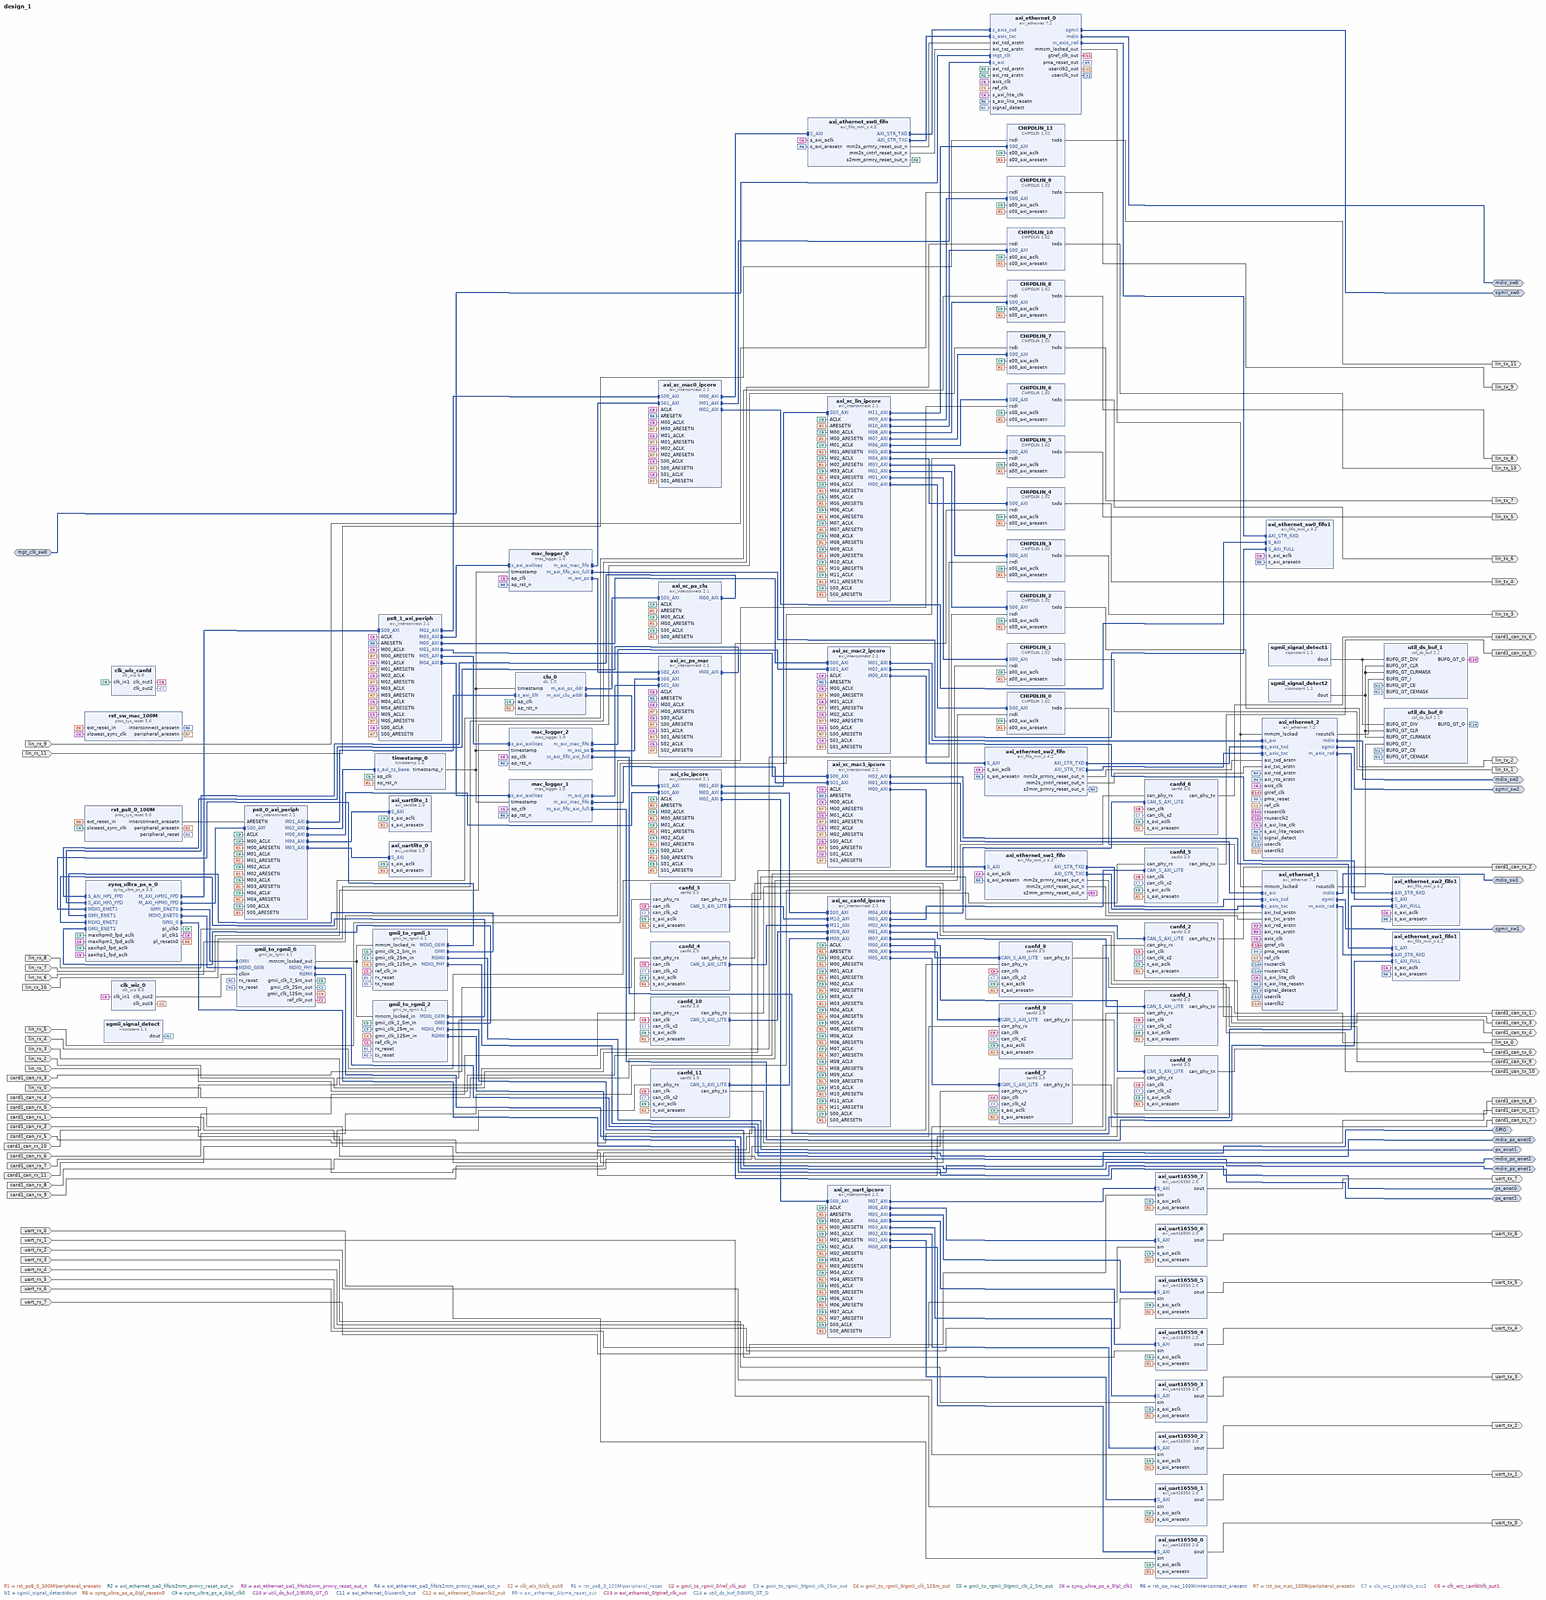
[diagram p0: block diagram of the top level, whole]
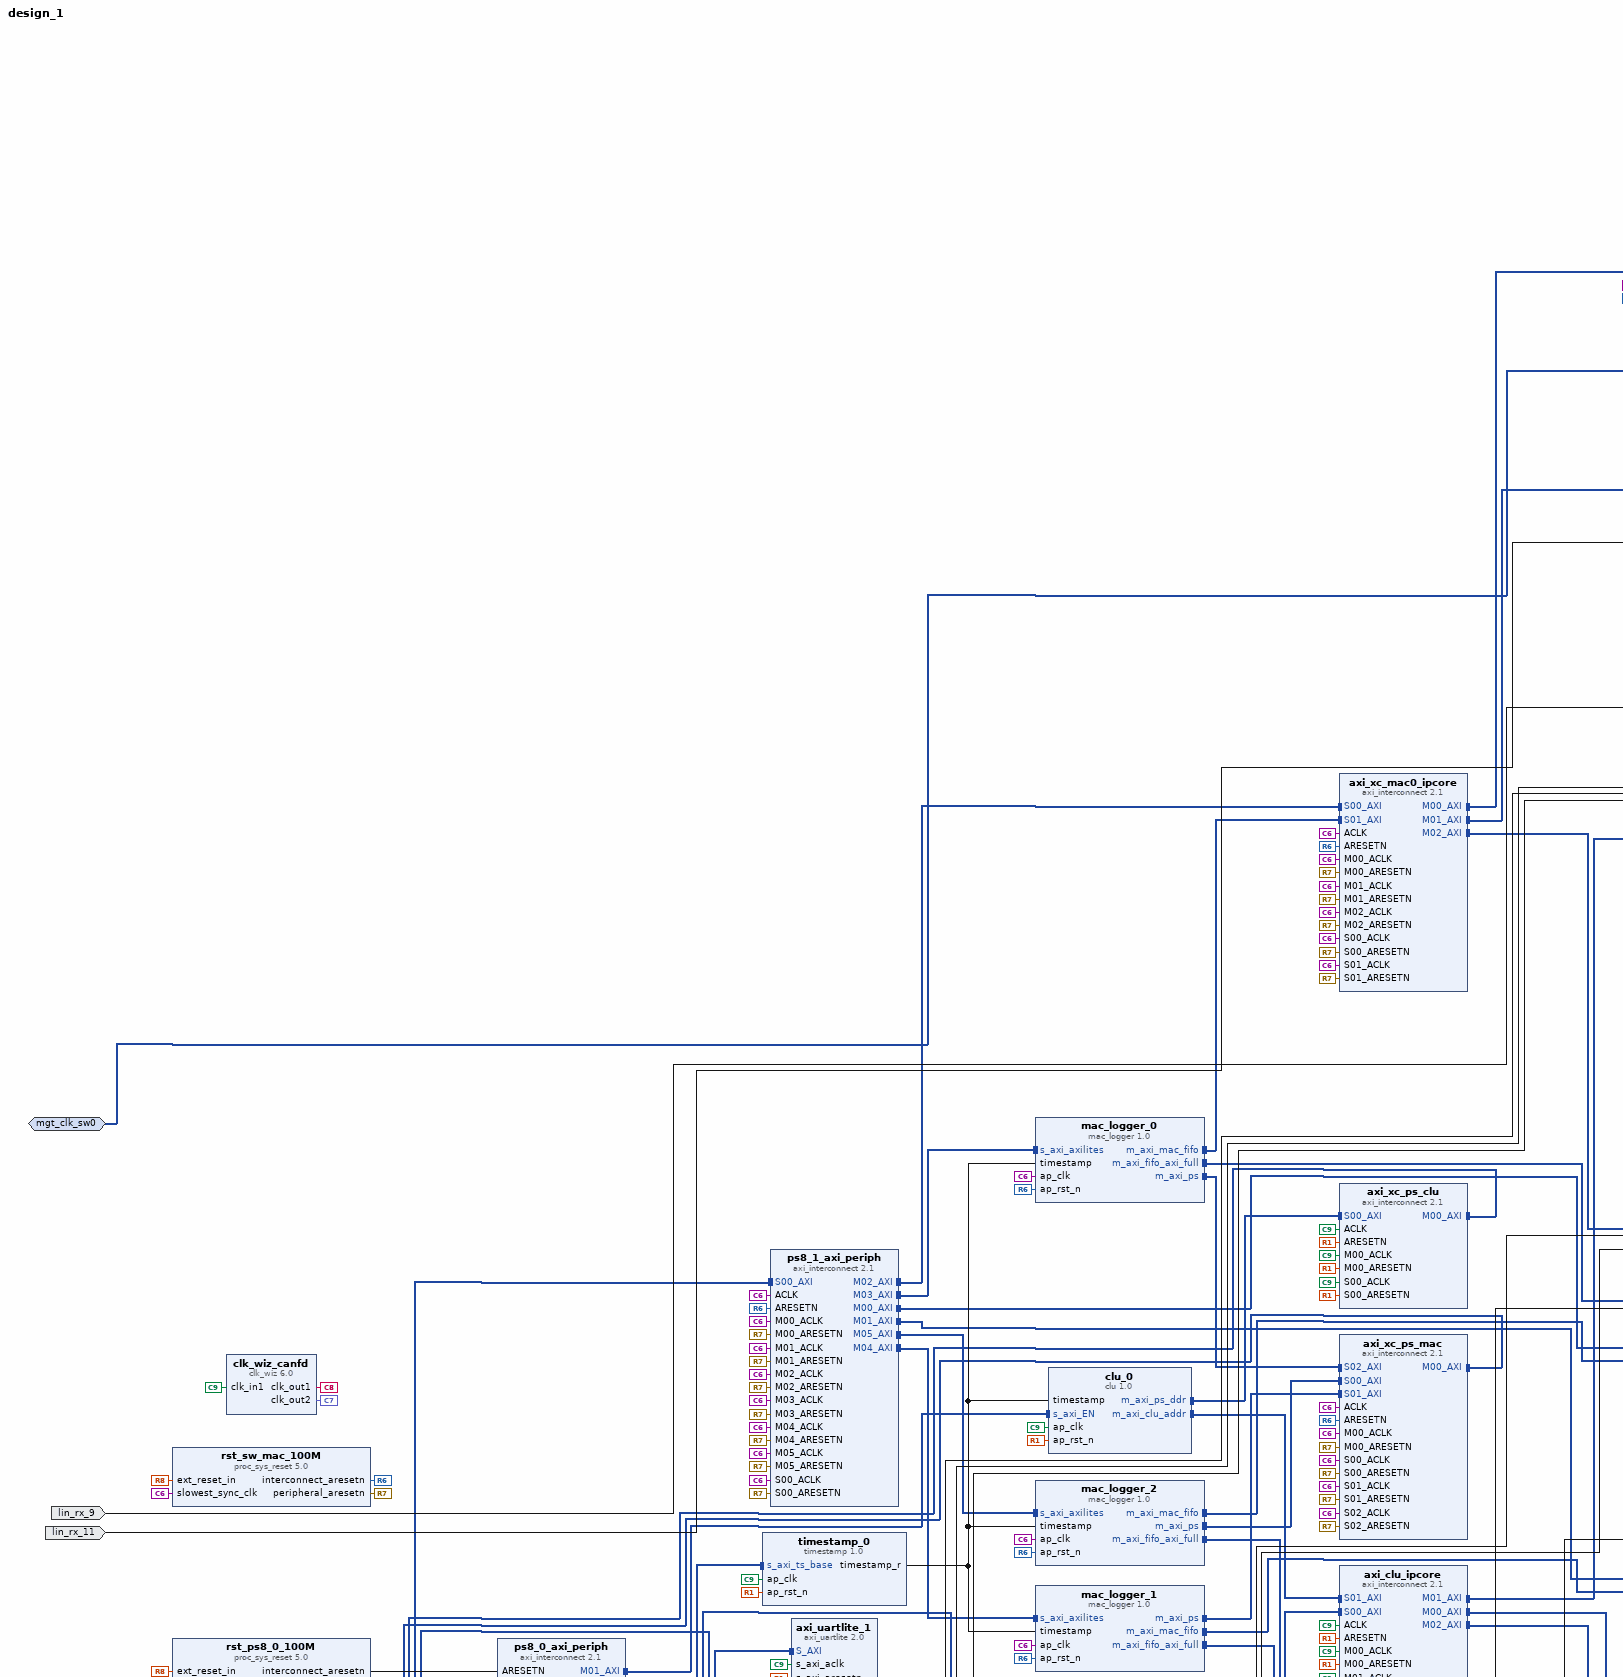
[diagram p1: block diagram of the top level, upper left part]
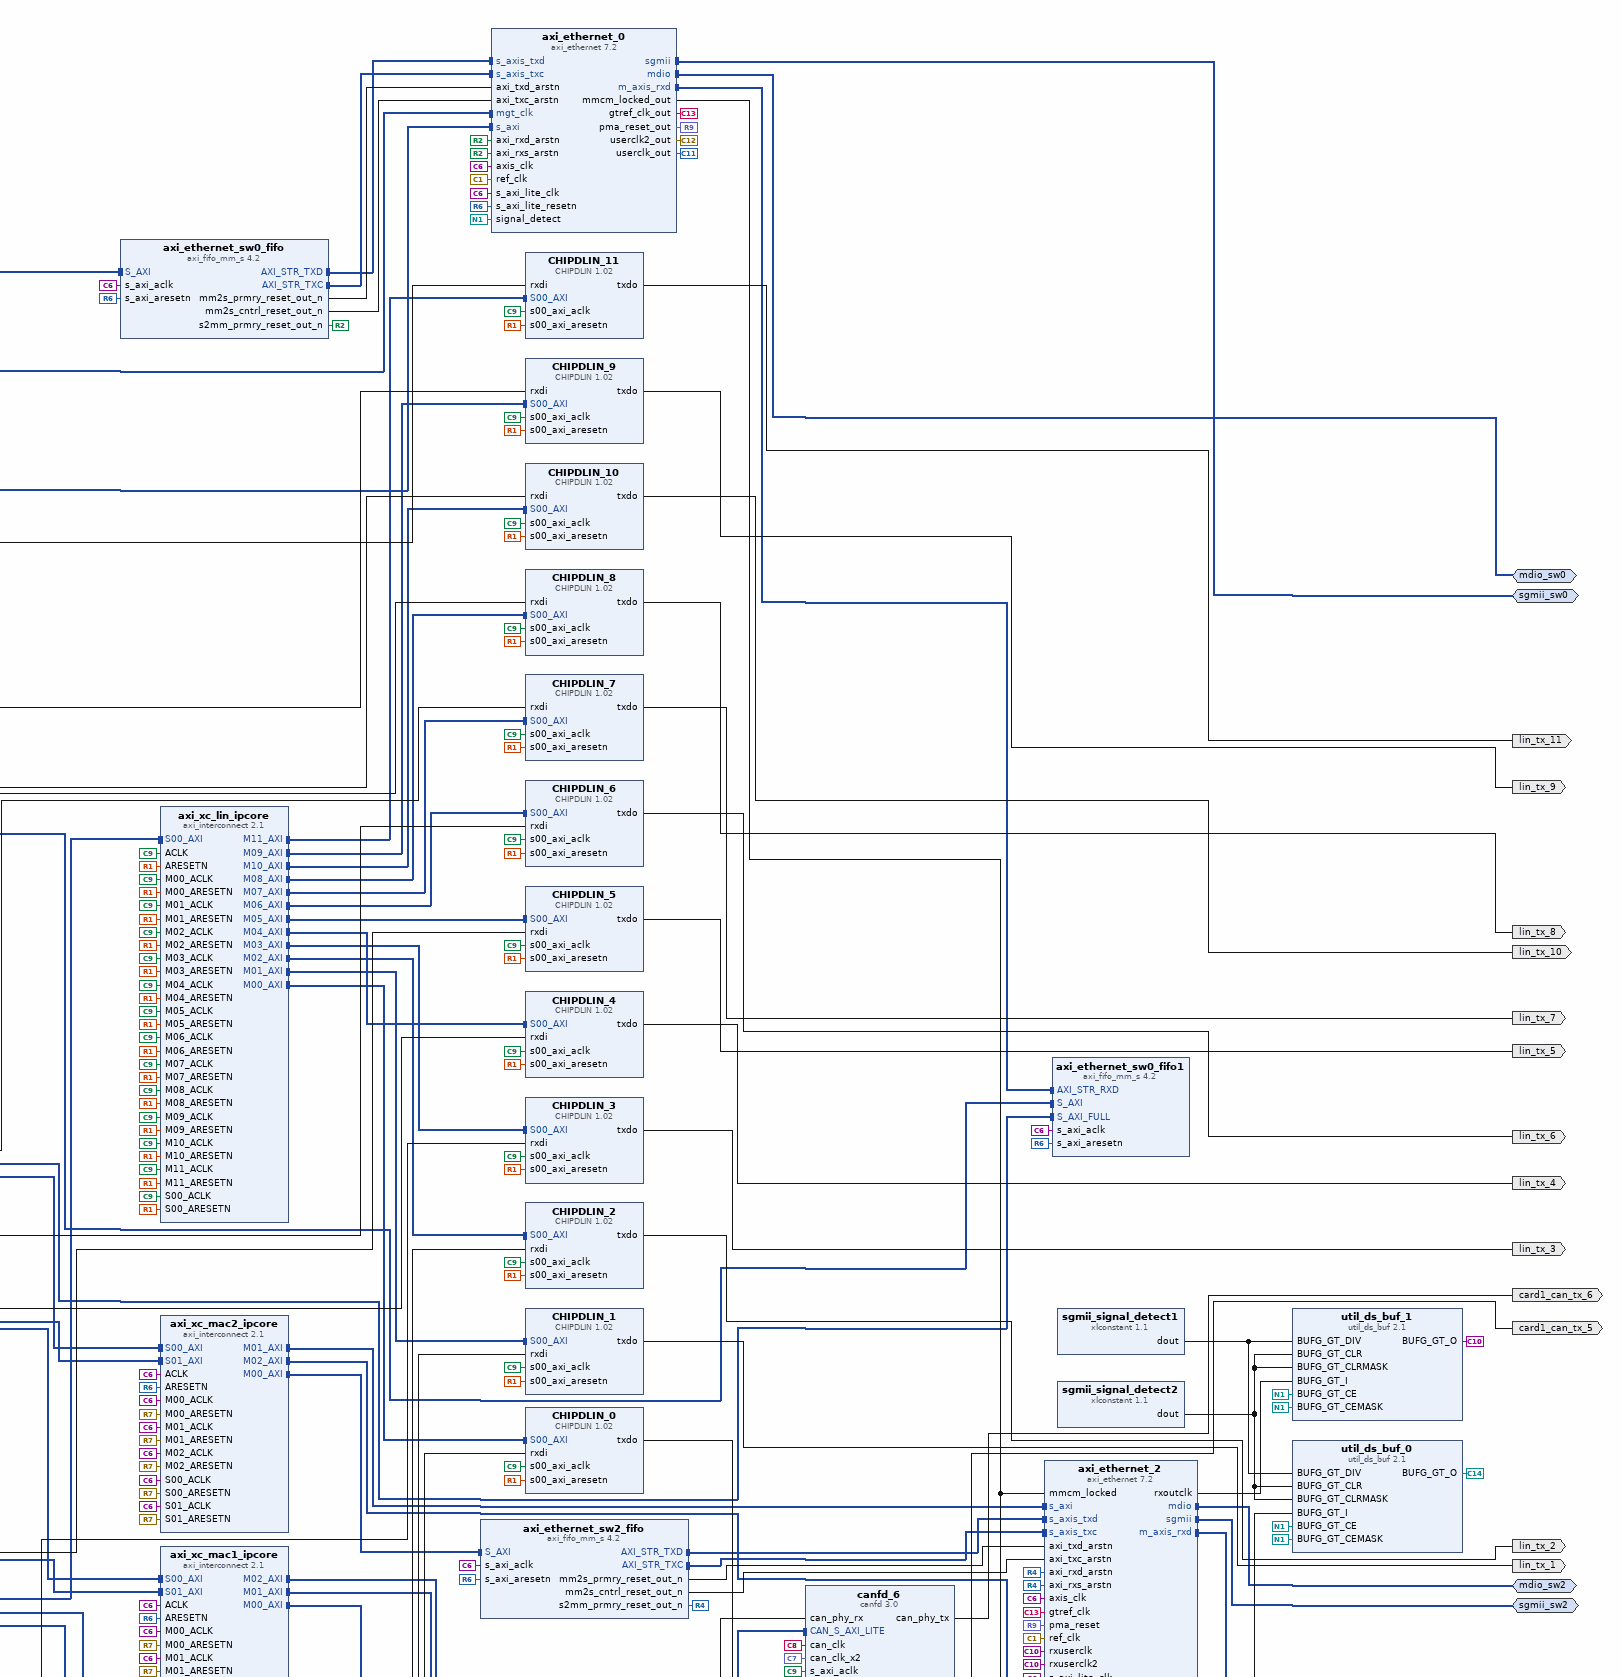
[diagram p2: block diagram of the top level, upper right part]
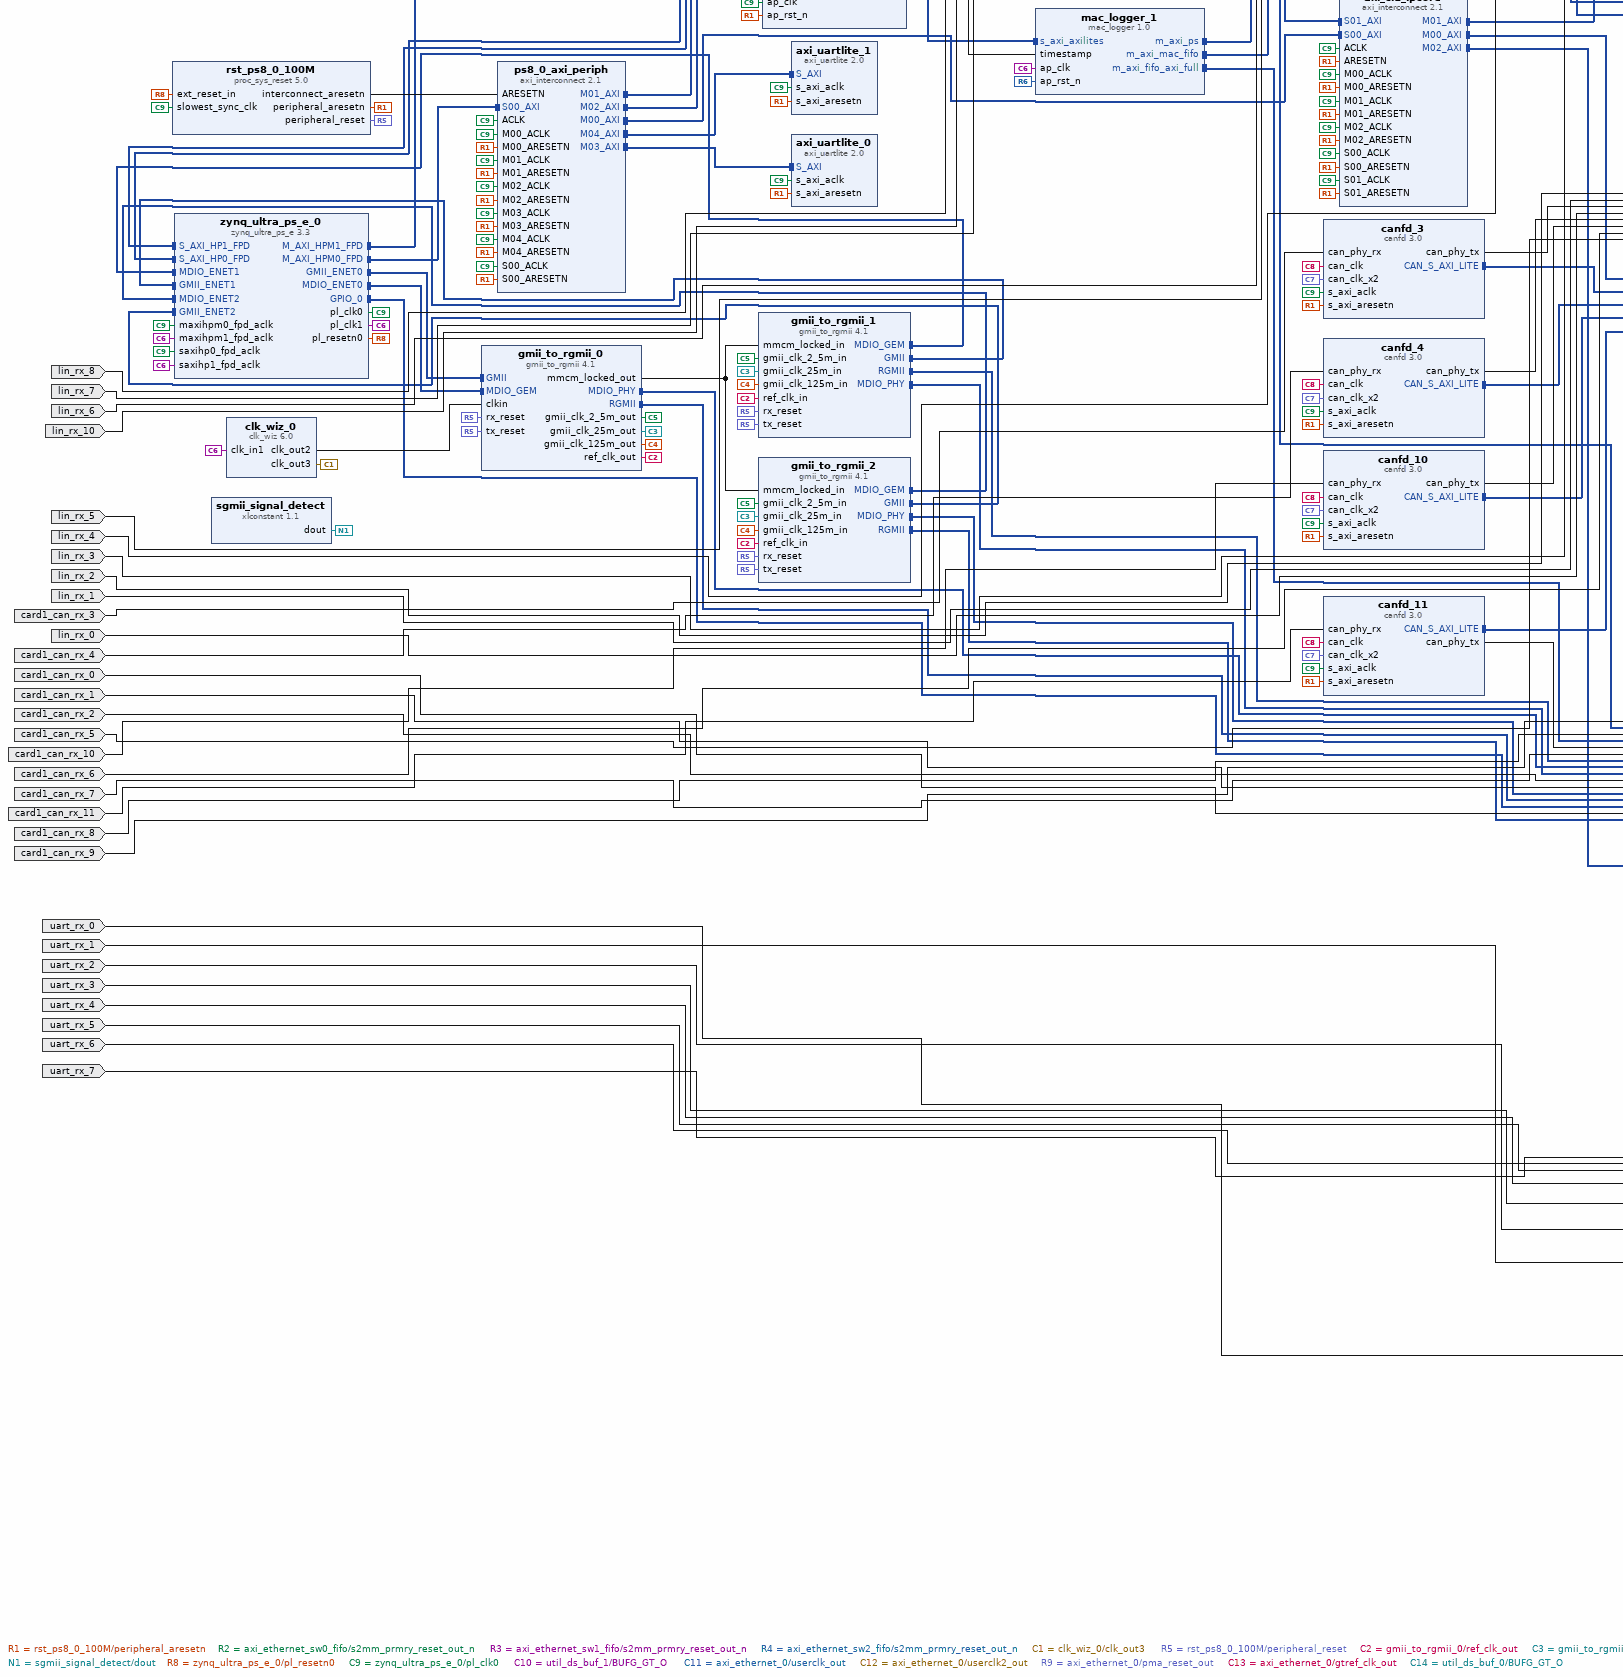
[diagram p3: block diagram of the top level, lower left part]
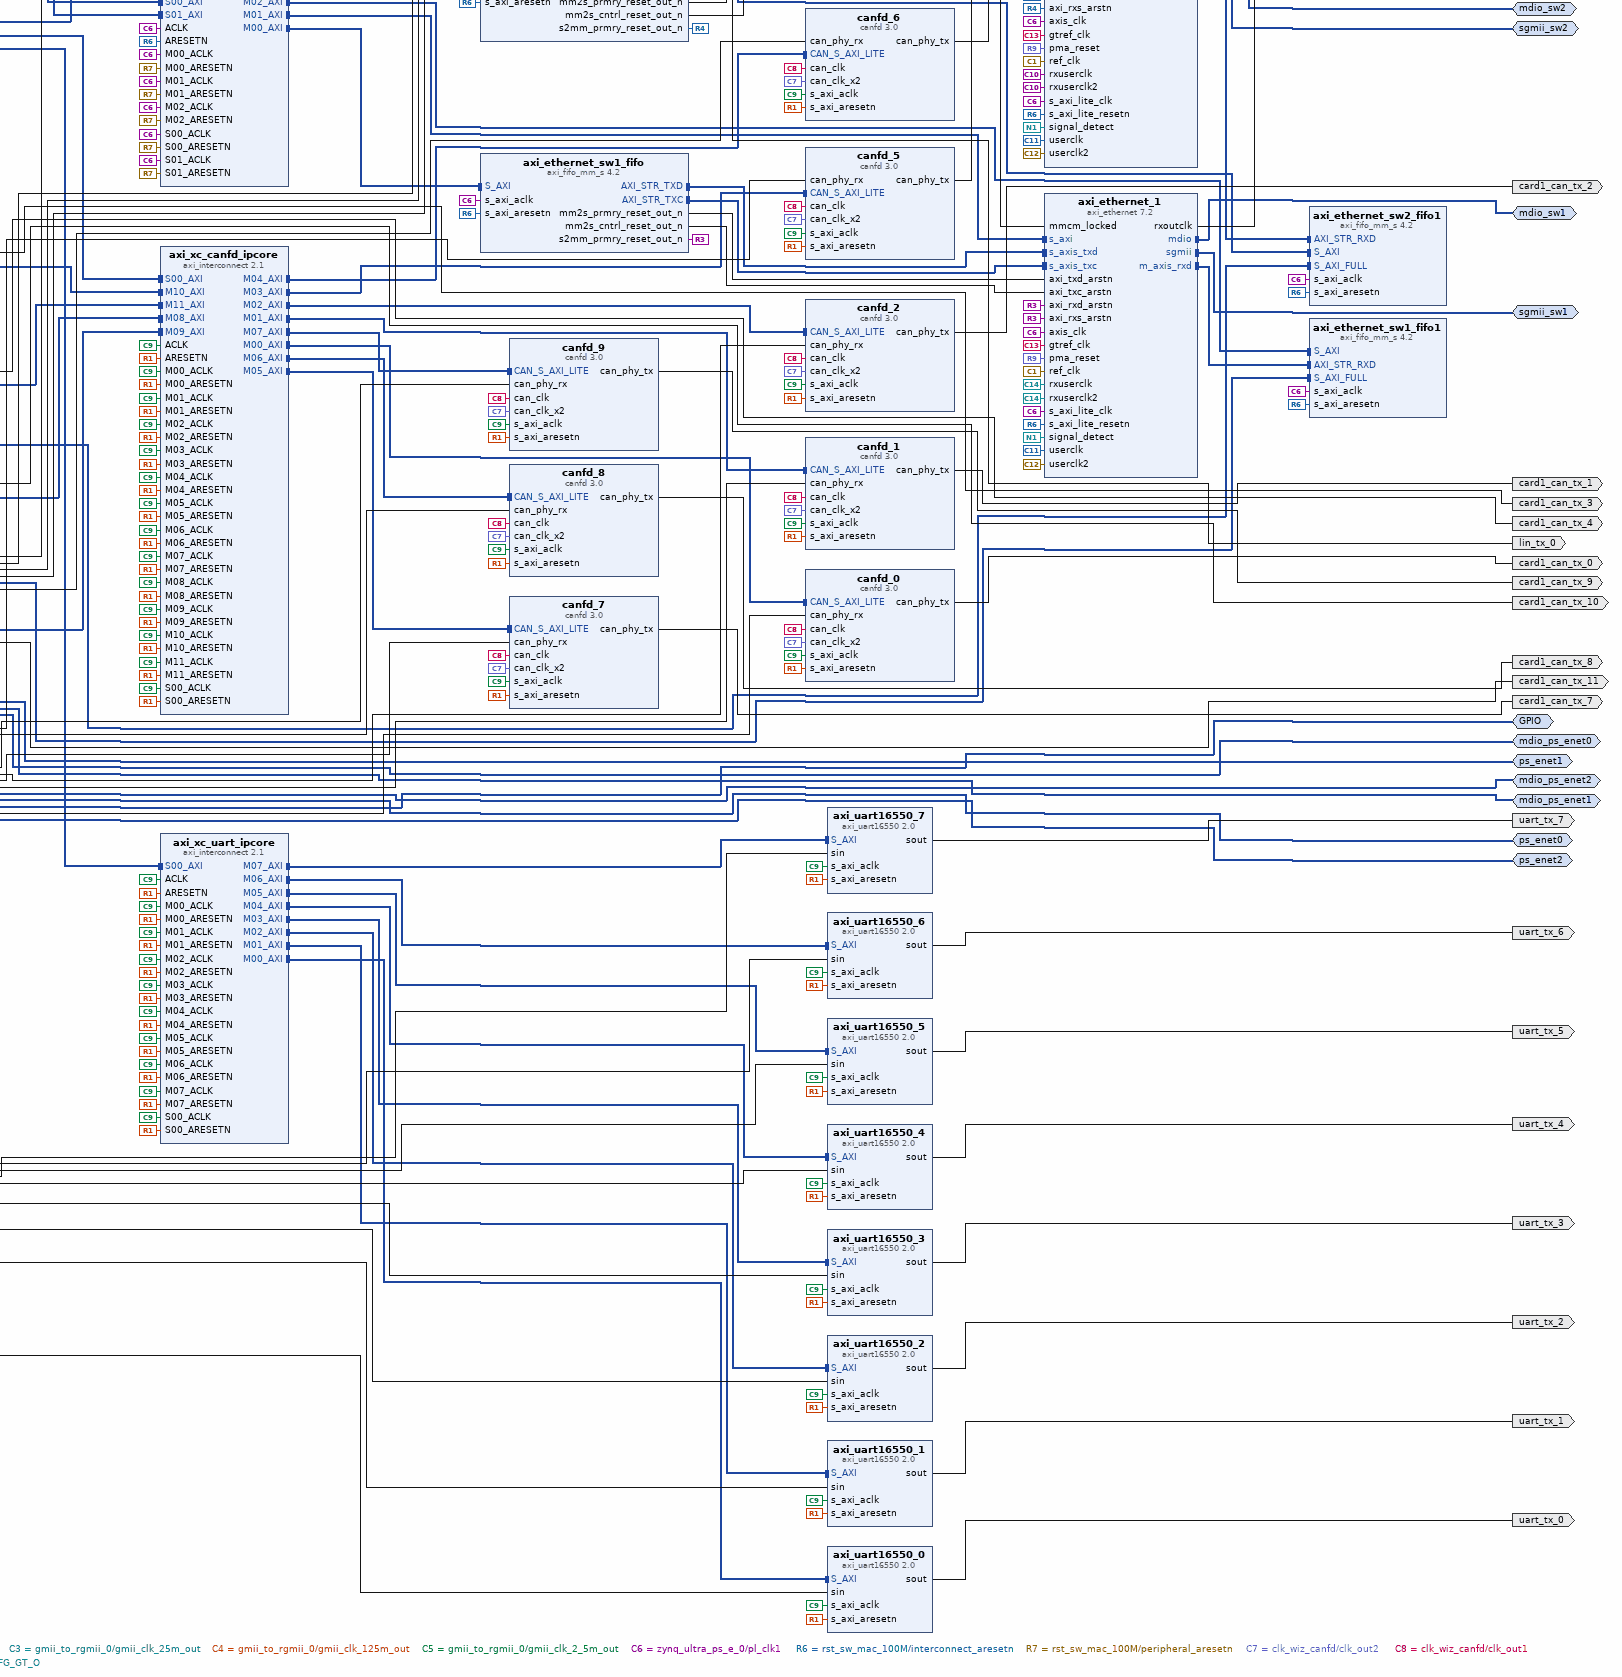
[diagram p4: block diagram of the top level, lower right part]
# Vivado block design design_1, xczu5ev-sfvc784-2-i, Vivado 2020.2
create_bd_design design_1

create_bd_intf_port -mode Master -vlnv xilinx.com:interface:mdio_rtl:1.0 mdio_sw0
create_bd_intf_port -mode Master -vlnv xilinx.com:interface:mdio_rtl:1.0 mdio_sw1
create_bd_intf_port -mode Master -vlnv xilinx.com:interface:mdio_rtl:1.0 mdio_sw2
create_bd_intf_port -mode Master -vlnv xilinx.com:interface:sgmii_rtl:1.0 sgmii_sw0
create_bd_intf_port -mode Master -vlnv xilinx.com:interface:sgmii_rtl:1.0 sgmii_sw2
create_bd_intf_port -mode Master -vlnv xilinx.com:interface:mdio_rtl:1.0 mdio_ps_enet0
create_bd_intf_port -mode Master -vlnv xilinx.com:interface:rgmii_rtl:1.0 ps_enet0
create_bd_intf_port -mode Master -vlnv xilinx.com:interface:mdio_rtl:1.0 mdio_ps_enet1
create_bd_intf_port -mode Master -vlnv xilinx.com:interface:rgmii_rtl:1.0 ps_enet1
create_bd_intf_port -mode Master -vlnv xilinx.com:interface:mdio_rtl:1.0 mdio_ps_enet2
create_bd_intf_port -mode Master -vlnv xilinx.com:interface:rgmii_rtl:1.0 ps_enet2
create_bd_intf_port -mode Slave -vlnv xilinx.com:interface:diff_clock_rtl:1.0 mgt_clk_sw0
set_property -dict {CONFIG.FREQ_HZ 125000000} [get_bd_intf_ports mgt_clk_sw0]
create_bd_intf_port -mode Master -vlnv xilinx.com:interface:sgmii_rtl:1.0 sgmii_sw1
create_bd_intf_port -mode Master -vlnv xilinx.com:interface:gpio_rtl:1.0 GPIO
create_bd_port -dir O -type data lin_tx_9
create_bd_port -dir I lin_rx_9
create_bd_port -dir I -type data lin_rx_8
create_bd_port -dir O -type data lin_tx_8
create_bd_port -dir O -type data lin_tx_7
create_bd_port -dir I -type data lin_rx_7
create_bd_port -dir O -type data lin_tx_6
create_bd_port -dir I -type data lin_rx_6
create_bd_port -dir O -type data lin_tx_5
create_bd_port -dir I -type data lin_rx_5
create_bd_port -dir O -type data lin_tx_4
create_bd_port -dir I -type data lin_rx_4
create_bd_port -dir O -type data lin_tx_3
create_bd_port -dir I -type data lin_rx_3
create_bd_port -dir O -type data lin_tx_2
create_bd_port -dir I -type data lin_rx_2
create_bd_port -dir O -type data lin_tx_1
create_bd_port -dir I -type data lin_rx_1
create_bd_port -dir O -type data lin_tx_0
create_bd_port -dir I -type data lin_rx_0
create_bd_port -dir O -type data lin_tx_10
create_bd_port -dir I -type data lin_rx_10
create_bd_port -dir O -type data lin_tx_11
create_bd_port -dir I -type data lin_rx_11
create_bd_port -dir O -type data card1_can_tx_1
create_bd_port -dir O -type data card1_can_tx_2
create_bd_port -dir O -type data card1_can_tx_3
create_bd_port -dir O -type data card1_can_tx_4
create_bd_port -dir O -type data card1_can_tx_5
create_bd_port -dir O -type data card1_can_tx_6
create_bd_port -dir O -type data card1_can_tx_7
create_bd_port -dir O -type data card1_can_tx_8
create_bd_port -dir O -type data card1_can_tx_9
create_bd_port -dir O -type data card1_can_tx_10
create_bd_port -dir O -type data card1_can_tx_11
create_bd_port -dir O -type data card1_can_tx_0
create_bd_port -dir I -type data card1_can_rx_0
create_bd_port -dir I -type data card1_can_rx_1
create_bd_port -dir I -type data card1_can_rx_2
create_bd_port -dir I -type data card1_can_rx_3
create_bd_port -dir I -type data card1_can_rx_4
create_bd_port -dir I -type data card1_can_rx_5
create_bd_port -dir I -type data card1_can_rx_6
create_bd_port -dir I -type data card1_can_rx_7
create_bd_port -dir I -type data card1_can_rx_8
create_bd_port -dir I -type data card1_can_rx_9
create_bd_port -dir I -type data card1_can_rx_10
create_bd_port -dir I -type data card1_can_rx_11
create_bd_port -dir O -type data uart_tx_1
create_bd_port -dir O -type data uart_tx_2
create_bd_port -dir O -type data uart_tx_3
create_bd_port -dir O -type data uart_tx_4
create_bd_port -dir O -type data uart_tx_5
create_bd_port -dir O -type data uart_tx_6
create_bd_port -dir O -type data uart_tx_7
create_bd_port -dir O -type data uart_tx_0
create_bd_port -dir I -type data uart_rx_0
create_bd_port -dir I -type data uart_rx_1
create_bd_port -dir I -type data uart_rx_2
create_bd_port -dir I -type data uart_rx_3
create_bd_port -dir I -type data uart_rx_4
create_bd_port -dir I -type data uart_rx_5
create_bd_port -dir I -type data uart_rx_6
create_bd_port -dir I -type data uart_rx_7

create_bd_cell -type ip -vlnv user.org:user:CHIPDLIN:1.02 CHIPDLIN_0
create_bd_cell -type ip -vlnv user.org:user:CHIPDLIN:1.02 CHIPDLIN_1
create_bd_cell -type ip -vlnv user.org:user:CHIPDLIN:1.02 CHIPDLIN_2
create_bd_cell -type ip -vlnv user.org:user:CHIPDLIN:1.02 CHIPDLIN_3
create_bd_cell -type ip -vlnv user.org:user:CHIPDLIN:1.02 CHIPDLIN_4
create_bd_cell -type ip -vlnv user.org:user:CHIPDLIN:1.02 CHIPDLIN_5
create_bd_cell -type ip -vlnv user.org:user:CHIPDLIN:1.02 CHIPDLIN_6
create_bd_cell -type ip -vlnv user.org:user:CHIPDLIN:1.02 CHIPDLIN_7
create_bd_cell -type ip -vlnv xilinx.com:ip:axi_fifo_mm_s:4.2 axi_ethernet_sw0_fifo
set_property -dict [list \
  CONFIG.C_DATA_INTERFACE_TYPE 0 \
  CONFIG.C_HAS_AXIS_TKEEP true \
  CONFIG.C_RX_FIFO_DEPTH 2048 \
  CONFIG.C_RX_FIFO_PE_THRESHOLD 10 \
  CONFIG.C_RX_FIFO_PF_THRESHOLD 2043 \
  CONFIG.C_TX_FIFO_DEPTH 4096 \
  CONFIG.C_TX_FIFO_PE_THRESHOLD 10 \
  CONFIG.C_TX_FIFO_PF_THRESHOLD 4000 \
] [get_bd_cells axi_ethernet_sw0_fifo]
create_bd_cell -type ip -vlnv xilinx.com:ip:axi_ethernet:7.2 axi_ethernet_1
set_property -dict [list \
  CONFIG.Frame_Filter false \
  CONFIG.PHYADDR 17 \
  CONFIG.PHY_TYPE SGMII \
  CONFIG.SupportLevel 0 \
  CONFIG.gtlocation X0Y5 \
  CONFIG.speed_1_2p5 1G \
] [get_bd_cells axi_ethernet_1]
create_bd_cell -type ip -vlnv xilinx.com:ip:axi_fifo_mm_s:4.2 axi_ethernet_sw1_fifo
set_property -dict [list \
  CONFIG.C_DATA_INTERFACE_TYPE 0 \
  CONFIG.C_HAS_AXIS_TKEEP true \
  CONFIG.C_RX_FIFO_DEPTH 2048 \
  CONFIG.C_RX_FIFO_PE_THRESHOLD 10 \
  CONFIG.C_RX_FIFO_PF_THRESHOLD 2043 \
  CONFIG.C_TX_FIFO_DEPTH 4096 \
  CONFIG.C_TX_FIFO_PE_THRESHOLD 10 \
  CONFIG.C_TX_FIFO_PF_THRESHOLD 4000 \
] [get_bd_cells axi_ethernet_sw1_fifo]
create_bd_cell -type ip -vlnv xilinx.com:ip:axi_ethernet:7.2 axi_ethernet_2
set_property -dict [list \
  CONFIG.Frame_Filter false \
  CONFIG.PHYADDR 18 \
  CONFIG.PHY_TYPE SGMII \
  CONFIG.SupportLevel 0 \
  CONFIG.gtlocation X0Y6 \
  CONFIG.speed_1_2p5 1G \
] [get_bd_cells axi_ethernet_2]
create_bd_cell -type ip -vlnv xilinx.com:ip:axi_fifo_mm_s:4.2 axi_ethernet_sw2_fifo
set_property -dict [list \
  CONFIG.C_DATA_INTERFACE_TYPE 0 \
  CONFIG.C_HAS_AXIS_TKEEP true \
  CONFIG.C_RX_FIFO_DEPTH 2048 \
  CONFIG.C_RX_FIFO_PE_THRESHOLD 10 \
  CONFIG.C_RX_FIFO_PF_THRESHOLD 2043 \
  CONFIG.C_TX_FIFO_DEPTH 4096 \
  CONFIG.C_TX_FIFO_PE_THRESHOLD 10 \
  CONFIG.C_TX_FIFO_PF_THRESHOLD 4000 \
] [get_bd_cells axi_ethernet_sw2_fifo]
create_bd_cell -type ip -vlnv xilinx.com:ip:axi_interconnect:2.1 ps8_1_axi_periph
set_property -dict {CONFIG.NUM_MI 6 CONFIG.NUM_SI 1} [get_bd_cells ps8_1_axi_periph]
create_bd_cell -type ip -vlnv xilinx.com:ip:axi_interconnect:2.1 axi_xc_lin_ipcore
set_property -dict {CONFIG.NUM_MI 12 CONFIG.NUM_SI 1} [get_bd_cells axi_xc_lin_ipcore]
create_bd_cell -type ip -vlnv xilinx.com:ip:axi_interconnect:2.1 axi_xc_canfd_ipcore
set_property -dict {CONFIG.NUM_MI 12 CONFIG.NUM_SI 1} [get_bd_cells axi_xc_canfd_ipcore]
create_bd_cell -type ip -vlnv xilinx.com:ip:canfd:3.0 canfd_0
set_property -dict {CONFIG.C_EN_APB 0 CONFIG.EN_RX_FIFO_1 false CONFIG.NUM_OF_TX_BUF 8} [get_bd_cells canfd_0]
create_bd_cell -type ip -vlnv xilinx.com:ip:canfd:3.0 canfd_1
set_property -dict {CONFIG.C_EN_APB 0 CONFIG.EN_RX_FIFO_1 false CONFIG.NUM_OF_TX_BUF 8} [get_bd_cells canfd_1]
create_bd_cell -type ip -vlnv xilinx.com:ip:canfd:3.0 canfd_2
set_property -dict {CONFIG.C_EN_APB 0 CONFIG.EN_RX_FIFO_1 false CONFIG.NUM_OF_TX_BUF 8} [get_bd_cells canfd_2]
create_bd_cell -type ip -vlnv xilinx.com:ip:canfd:3.0 canfd_5
set_property -dict {CONFIG.C_EN_APB 0 CONFIG.EN_RX_FIFO_1 false CONFIG.NUM_OF_TX_BUF 8} [get_bd_cells canfd_5]
create_bd_cell -type ip -vlnv xilinx.com:ip:canfd:3.0 canfd_6
set_property -dict {CONFIG.C_EN_APB 0 CONFIG.EN_RX_FIFO_1 false CONFIG.NUM_OF_TX_BUF 8} [get_bd_cells canfd_6]
create_bd_cell -type ip -vlnv xilinx.com:ip:canfd:3.0 canfd_7
set_property -dict {CONFIG.C_EN_APB 0 CONFIG.EN_RX_FIFO_1 false CONFIG.NUM_OF_TX_BUF 8} [get_bd_cells canfd_7]
create_bd_cell -type ip -vlnv xilinx.com:ip:canfd:3.0 canfd_8
set_property -dict {CONFIG.C_EN_APB 0 CONFIG.EN_RX_FIFO_1 false CONFIG.NUM_OF_TX_BUF 8} [get_bd_cells canfd_8]
create_bd_cell -type ip -vlnv xilinx.com:ip:canfd:3.0 canfd_9
set_property -dict {CONFIG.C_EN_APB 0 CONFIG.EN_RX_FIFO_1 false CONFIG.NUM_OF_TX_BUF 8} [get_bd_cells canfd_9]
create_bd_cell -type ip -vlnv xilinx.com:ip:clk_wiz:6.0 clk_wiz_0
set_property -dict [list \
  CONFIG.CLKOUT1_JITTER 92.548 \
  CONFIG.CLKOUT1_PHASE_ERROR 76.967 \
  CONFIG.CLKOUT1_REQUESTED_OUT_FREQ 125.000 \
  CONFIG.CLKOUT2_JITTER 76.316 \
  CONFIG.CLKOUT2_PHASE_ERROR 76.967 \
  CONFIG.CLKOUT2_REQUESTED_OUT_FREQ 375 \
  CONFIG.CLKOUT2_USED true \
  CONFIG.CLKOUT3_JITTER 108.951 \
  CONFIG.CLKOUT3_PHASE_ERROR 76.967 \
  CONFIG.CLKOUT3_REQUESTED_OUT_FREQ 50.000 \
  CONFIG.CLKOUT3_USED true \
  CONFIG.CLKOUT4_DRIVES BUFG \
  CONFIG.CLKOUT4_JITTER 92.548 \
  CONFIG.CLKOUT4_PHASE_ERROR 76.967 \
  CONFIG.CLKOUT4_REQUESTED_OUT_FREQ 125 \
  CONFIG.CLKOUT4_USED true \
  CONFIG.MMCM_CLKFBOUT_MULT_F 15.000 \
  CONFIG.MMCM_CLKOUT0_DIVIDE_F 12.000 \
  CONFIG.MMCM_CLKOUT1_DIVIDE 4 \
  CONFIG.MMCM_CLKOUT2_DIVIDE 30 \
  CONFIG.MMCM_CLKOUT3_DIVIDE 12 \
  CONFIG.MMCM_DIVCLK_DIVIDE 1 \
  CONFIG.NUM_OUT_CLKS 4 \
  CONFIG.USE_LOCKED false \
  CONFIG.USE_RESET false \
] [get_bd_cells clk_wiz_0]
create_bd_cell -type ip -vlnv xilinx.com:ip:clk_wiz:6.0 clk_wiz_canfd
set_property -dict [list \
  CONFIG.CLKOUT1_DRIVES Buffer \
  CONFIG.CLKOUT1_JITTER 174.629 \
  CONFIG.CLKOUT1_PHASE_ERROR 114.212 \
  CONFIG.CLKOUT1_REQUESTED_OUT_FREQ 40 \
  CONFIG.CLKOUT2_DRIVES Buffer \
  CONFIG.CLKOUT2_JITTER 151.652 \
  CONFIG.CLKOUT2_PHASE_ERROR 114.212 \
  CONFIG.CLKOUT2_REQUESTED_OUT_FREQ 80 \
  CONFIG.CLKOUT2_USED true \
  CONFIG.CLKOUT3_DRIVES Buffer \
  CONFIG.CLKOUT4_DRIVES Buffer \
  CONFIG.CLKOUT5_DRIVES Buffer \
  CONFIG.CLKOUT6_DRIVES Buffer \
  CONFIG.CLKOUT7_DRIVES Buffer \
  CONFIG.MMCM_BANDWIDTH OPTIMIZED \
  CONFIG.MMCM_CLKFBOUT_MULT_F 8 \
  CONFIG.MMCM_CLKOUT0_DIVIDE_F 20 \
  CONFIG.MMCM_CLKOUT1_DIVIDE 10 \
  CONFIG.MMCM_COMPENSATION AUTO \
  CONFIG.NUM_OUT_CLKS 2 \
  CONFIG.PRIMITIVE PLL \
  CONFIG.USE_LOCKED false \
  CONFIG.USE_RESET false \
] [get_bd_cells clk_wiz_canfd]
create_bd_cell -type ip -vlnv xilinx.com:ip:gmii_to_rgmii:4.1 gmii_to_rgmii_0
set_property -dict {CONFIG.C_USE_IDELAY_CTRL true CONFIG.SupportLevel Include_Shared_Logic_in_Core} [get_bd_cells gmii_to_rgmii_0]
create_bd_cell -type ip -vlnv xilinx.com:ip:gmii_to_rgmii:4.1 gmii_to_rgmii_1
set_property -dict {CONFIG.C_PHYADDR 9 CONFIG.C_USE_IDELAY_CTRL true} [get_bd_cells gmii_to_rgmii_1]
create_bd_cell -type ip -vlnv xilinx.com:ip:gmii_to_rgmii:4.1 gmii_to_rgmii_2
set_property -dict {CONFIG.C_PHYADDR 10 CONFIG.C_USE_IDELAY_CTRL true} [get_bd_cells gmii_to_rgmii_2]
create_bd_cell -type ip -vlnv xilinx.com:ip:proc_sys_reset:5.0 rst_sw_mac_100M
create_bd_cell -type ip -vlnv xilinx.com:ip:axi_interconnect:2.1 ps8_0_axi_periph
set_property -dict {CONFIG.NUM_MI 5} [get_bd_cells ps8_0_axi_periph]
create_bd_cell -type ip -vlnv xilinx.com:ip:proc_sys_reset:5.0 rst_ps8_0_100M
create_bd_cell -type ip -vlnv xilinx.com:ip:zynq_ultra_ps_e:3.3 zynq_ultra_ps_e_0
set_property -dict [list \
  CONFIG.CAN0_BOARD_INTERFACE custom \
  CONFIG.CAN1_BOARD_INTERFACE custom \
  CONFIG.CSU_BOARD_INTERFACE custom \
  CONFIG.DP_BOARD_INTERFACE custom \
  CONFIG.GEM0_BOARD_INTERFACE custom \
  CONFIG.GEM1_BOARD_INTERFACE custom \
  CONFIG.GEM2_BOARD_INTERFACE custom \
  CONFIG.GEM3_BOARD_INTERFACE custom \
  CONFIG.GPIO_BOARD_INTERFACE custom \
  CONFIG.IIC0_BOARD_INTERFACE custom \
  CONFIG.IIC1_BOARD_INTERFACE custom \
  CONFIG.NAND_BOARD_INTERFACE custom \
  CONFIG.PCIE_BOARD_INTERFACE custom \
  CONFIG.PJTAG_BOARD_INTERFACE custom \
  CONFIG.PMU_BOARD_INTERFACE custom \
  CONFIG.PSU_BANK_0_IO_STANDARD LVCMOS18 \
  CONFIG.PSU_BANK_1_IO_STANDARD LVCMOS18 \
  CONFIG.PSU_BANK_2_IO_STANDARD LVCMOS18 \
  CONFIG.PSU_BANK_3_IO_STANDARD LVCMOS33 \
  CONFIG.PSU_USB3__DUAL_CLOCK_ENABLE 1 \
  CONFIG.PSU__CAN1__PERIPHERAL__ENABLE 0 \
  CONFIG.PSU__CRF_APB__ACPU_CTRL__FREQMHZ 1333.333 \
  CONFIG.PSU__CRF_APB__ACPU_CTRL__SRCSEL APLL \
  CONFIG.PSU__CRF_APB__APLL_CTRL__SRCSEL PSS_REF_CLK \
  CONFIG.PSU__CRF_APB__DBG_FPD_CTRL__FREQMHZ 250 \
  CONFIG.PSU__CRF_APB__DBG_FPD_CTRL__SRCSEL IOPLL \
  CONFIG.PSU__CRF_APB__DBG_TRACE_CTRL__FREQMHZ 250 \
  CONFIG.PSU__CRF_APB__DBG_TRACE_CTRL__SRCSEL IOPLL \
  CONFIG.PSU__CRF_APB__DBG_TSTMP_CTRL__FREQMHZ 250 \
  CONFIG.PSU__CRF_APB__DBG_TSTMP_CTRL__SRCSEL IOPLL \
  CONFIG.PSU__CRF_APB__DDR_CTRL__FREQMHZ 1200 \
  CONFIG.PSU__CRF_APB__DDR_CTRL__SRCSEL DPLL \
  CONFIG.PSU__CRF_APB__DPDMA_REF_CTRL__FREQMHZ 600 \
  CONFIG.PSU__CRF_APB__DPDMA_REF_CTRL__SRCSEL DPLL \
  CONFIG.PSU__CRF_APB__DPLL_CTRL__SRCSEL PSS_REF_CLK \
  CONFIG.PSU__CRF_APB__DP_AUDIO_REF_CTRL__SRCSEL RPLL \
  CONFIG.PSU__CRF_APB__DP_STC_REF_CTRL__SRCSEL RPLL \
  CONFIG.PSU__CRF_APB__DP_VIDEO_REF_CTRL__SRCSEL VPLL \
  CONFIG.PSU__CRF_APB__GDMA_REF_CTRL__FREQMHZ 600 \
  CONFIG.PSU__CRF_APB__GDMA_REF_CTRL__SRCSEL DPLL \
  CONFIG.PSU__CRF_APB__GPU_REF_CTRL__FREQMHZ 600 \
  CONFIG.PSU__CRF_APB__GPU_REF_CTRL__SRCSEL DPLL \
  CONFIG.PSU__CRF_APB__TOPSW_LSBUS_CTRL__FREQMHZ 100 \
  CONFIG.PSU__CRF_APB__TOPSW_LSBUS_CTRL__SRCSEL IOPLL \
  CONFIG.PSU__CRF_APB__TOPSW_MAIN_CTRL__FREQMHZ 533.333 \
  CONFIG.PSU__CRF_APB__TOPSW_MAIN_CTRL__SRCSEL APLL \
  CONFIG.PSU__CRF_APB__VPLL_CTRL__SRCSEL PSS_REF_CLK \
  CONFIG.PSU__CRL_APB__ADMA_REF_CTRL__FREQMHZ 500 \
  CONFIG.PSU__CRL_APB__ADMA_REF_CTRL__SRCSEL IOPLL \
  CONFIG.PSU__CRL_APB__CAN1_REF_CTRL__FREQMHZ 100 \
  CONFIG.PSU__CRL_APB__CAN1_REF_CTRL__SRCSEL IOPLL \
  CONFIG.PSU__CRL_APB__CPU_R5_CTRL__FREQMHZ 500 \
  CONFIG.PSU__CRL_APB__CPU_R5_CTRL__SRCSEL IOPLL \
  CONFIG.PSU__CRL_APB__DBG_LPD_CTRL__FREQMHZ 250 \
  CONFIG.PSU__CRL_APB__DBG_LPD_CTRL__SRCSEL IOPLL \
  CONFIG.PSU__CRL_APB__GEM3_REF_CTRL__FREQMHZ 125 \
  CONFIG.PSU__CRL_APB__GEM3_REF_CTRL__SRCSEL IOPLL \
  CONFIG.PSU__CRL_APB__I2C0_REF_CTRL__FREQMHZ 100 \
  CONFIG.PSU__CRL_APB__I2C0_REF_CTRL__SRCSEL IOPLL \
  CONFIG.PSU__CRL_APB__I2C1_REF_CTRL__FREQMHZ 100 \
  CONFIG.PSU__CRL_APB__I2C1_REF_CTRL__SRCSEL IOPLL \
  CONFIG.PSU__CRL_APB__IOPLL_CTRL__SRCSEL PSS_REF_CLK \
  CONFIG.PSU__CRL_APB__IOU_SWITCH_CTRL__FREQMHZ 267 \
  CONFIG.PSU__CRL_APB__IOU_SWITCH_CTRL__SRCSEL RPLL \
  CONFIG.PSU__CRL_APB__LPD_LSBUS_CTRL__FREQMHZ 100 \
  CONFIG.PSU__CRL_APB__LPD_LSBUS_CTRL__SRCSEL IOPLL \
  CONFIG.PSU__CRL_APB__LPD_SWITCH_CTRL__FREQMHZ 500 \
  CONFIG.PSU__CRL_APB__LPD_SWITCH_CTRL__SRCSEL IOPLL \
  CONFIG.PSU__CRL_APB__PCAP_CTRL__FREQMHZ 200 \
  CONFIG.PSU__CRL_APB__PCAP_CTRL__SRCSEL IOPLL \
  CONFIG.PSU__CRL_APB__PL0_REF_CTRL__FREQMHZ 100 \
  CONFIG.PSU__CRL_APB__PL0_REF_CTRL__SRCSEL RPLL \
  CONFIG.PSU__CRL_APB__QSPI_REF_CTRL__FREQMHZ 300 \
  CONFIG.PSU__CRL_APB__QSPI_REF_CTRL__SRCSEL IOPLL \
  CONFIG.PSU__CRL_APB__RPLL_CTRL__SRCSEL PSS_REF_CLK \
  CONFIG.PSU__CRL_APB__SDIO0_REF_CTRL__SRCSEL IOPLL \
  CONFIG.PSU__CRL_APB__SDIO1_REF_CTRL__FREQMHZ 200 \
  CONFIG.PSU__CRL_APB__SDIO1_REF_CTRL__SRCSEL IOPLL \
  CONFIG.PSU__CRL_APB__TIMESTAMP_REF_CTRL__FREQMHZ 100 \
  CONFIG.PSU__CRL_APB__TIMESTAMP_REF_CTRL__SRCSEL PSS_REF_CLK \
  CONFIG.PSU__CRL_APB__UART0_REF_CTRL__FREQMHZ 100 \
  CONFIG.PSU__CRL_APB__UART0_REF_CTRL__SRCSEL IOPLL \
  CONFIG.PSU__CRL_APB__UART1_REF_CTRL__FREQMHZ 100 \
  CONFIG.PSU__CRL_APB__UART1_REF_CTRL__SRCSEL IOPLL \
  CONFIG.PSU__CRL_APB__USB0_BUS_REF_CTRL__FREQMHZ 250 \
  CONFIG.PSU__CRL_APB__USB0_BUS_REF_CTRL__SRCSEL IOPLL \
  CONFIG.PSU__CRL_APB__USB3_DUAL_REF_CTRL__FREQMHZ 20 \
  CONFIG.PSU__CRL_APB__USB3_DUAL_REF_CTRL__SRCSEL IOPLL \
  CONFIG.PSU__CRL_APB__USB3__ENABLE 1 \
  CONFIG.PSU__CSUPMU__PERIPHERAL__VALID 0 \
  CONFIG.PSU__DDRC__BUS_WIDTH {64 Bit} \
  CONFIG.PSU__DDRC__COMPONENTS Components \
  CONFIG.PSU__DDRC__DEVICE_CAPACITY {8192 MBits} \
  CONFIG.PSU__DDRC__DRAM_WIDTH {16 Bits} \
  CONFIG.PSU__DDRC__ECC Disabled \
  CONFIG.PSU__DDRC__MEMORY_TYPE {DDR 4} \
  CONFIG.PSU__DDRC__SPEED_BIN DDR4_2400P \
  CONFIG.PSU__DDR_HIGH_ADDRESS_GUI_ENABLE 1 \
  CONFIG.PSU__DDR__INTERFACE__FREQMHZ 600.000 \
  CONFIG.PSU__DEVICE_TYPE EV \
  CONFIG.PSU__DISPLAYPORT__PERIPHERAL__ENABLE 0 \
  CONFIG.PSU__DLL__ISUSED 1 \
  CONFIG.PSU__ENET0__GRP_MDIO__ENABLE 1 \
  CONFIG.PSU__ENET0__GRP_MDIO__IO EMIO \
  CONFIG.PSU__ENET0__PERIPHERAL__ENABLE 1 \
  CONFIG.PSU__ENET0__PERIPHERAL__IO EMIO \
  CONFIG.PSU__ENET1__GRP_MDIO__ENABLE 1 \
  CONFIG.PSU__ENET1__GRP_MDIO__IO EMIO \
  CONFIG.PSU__ENET1__PERIPHERAL__ENABLE 1 \
  CONFIG.PSU__ENET1__PERIPHERAL__IO EMIO \
  CONFIG.PSU__ENET2__GRP_MDIO__ENABLE 1 \
  CONFIG.PSU__ENET2__GRP_MDIO__IO EMIO \
  CONFIG.PSU__ENET2__PERIPHERAL__ENABLE 1 \
  CONFIG.PSU__ENET2__PERIPHERAL__IO EMIO \
  CONFIG.PSU__ENET3__FIFO__ENABLE 0 \
  CONFIG.PSU__ENET3__GRP_MDIO__ENABLE 1 \
  CONFIG.PSU__ENET3__GRP_MDIO__IO {MIO 76 .. 77} \
  CONFIG.PSU__ENET3__PERIPHERAL__ENABLE 1 \
  CONFIG.PSU__ENET3__PERIPHERAL__IO {MIO 64 .. 75} \
  CONFIG.PSU__ENET3__PTP__ENABLE 0 \
  CONFIG.PSU__ENET3__TSU__ENABLE 0 \
  CONFIG.PSU__FPD_SLCR__WDT1__FREQMHZ 100 \
  CONFIG.PSU__FPGA_PL0_ENABLE 1 \
  CONFIG.PSU__FPGA_PL1_ENABLE 1 \
  CONFIG.PSU__GEM3_COHERENCY 0 \
  CONFIG.PSU__GEM3_ROUTE_THROUGH_FPD 0 \
  CONFIG.PSU__GEM__TSU__ENABLE 0 \
  CONFIG.PSU__GPIO0_MIO__PERIPHERAL__ENABLE 0 \
  CONFIG.PSU__GPIO1_MIO__IO {MIO 26 .. 51} \
  CONFIG.PSU__GPIO1_MIO__PERIPHERAL__ENABLE 1 \
  CONFIG.PSU__GPIO_EMIO_WIDTH 4 \
  CONFIG.PSU__GPIO_EMIO__PERIPHERAL__ENABLE 1 \
  CONFIG.PSU__GPIO_EMIO__PERIPHERAL__IO 4 \
  CONFIG.PSU__I2C0__PERIPHERAL__ENABLE 0 \
  CONFIG.PSU__I2C1__PERIPHERAL__ENABLE 1 \
  CONFIG.PSU__I2C1__PERIPHERAL__IO {MIO 24 .. 25} \
  CONFIG.PSU__IOU_SLCR__IOU_TTC_APB_CLK__TTC0_SEL APB \
  CONFIG.PSU__IOU_SLCR__IOU_TTC_APB_CLK__TTC1_SEL APB \
  CONFIG.PSU__IOU_SLCR__IOU_TTC_APB_CLK__TTC2_SEL APB \
  CONFIG.PSU__IOU_SLCR__IOU_TTC_APB_CLK__TTC3_SEL APB \
  CONFIG.PSU__IOU_SLCR__WDT0__FREQMHZ 100 \
  CONFIG.PSU__LPD_SLCR__CSUPMU__FREQMHZ 100 \
  CONFIG.PSU__MAXIGP0__DATA_WIDTH 32 \
  CONFIG.PSU__MAXIGP1__DATA_WIDTH 32 \
  CONFIG.PSU__OVERRIDE_HPX_QOS 0 \
  CONFIG.PSU__OVERRIDE__BASIC_CLOCK 0 \
  CONFIG.PSU__PCIE__BAR0_ENABLE 1 \
  CONFIG.PSU__PCIE__BAR0_SCALE Megabytes \
  CONFIG.PSU__PCIE__BAR0_SIZE 1 \
  CONFIG.PSU__PCIE__BAR0_TYPE Memory \
  CONFIG.PSU__PCIE__BAR0_VAL 0xfff00000 \
  CONFIG.PSU__PCIE__BAR1_VAL 0x0 \
  CONFIG.PSU__PCIE__BAR2_VAL 0x0 \
  CONFIG.PSU__PCIE__BAR3_VAL 0x0 \
  CONFIG.PSU__PCIE__BAR4_VAL 0x0 \
  CONFIG.PSU__PCIE__BAR5_VAL 0x0 \
  CONFIG.PSU__PCIE__CLASS_CODE_BASE 0x06 \
  CONFIG.PSU__PCIE__CLASS_CODE_INTERFACE 0x0 \
  CONFIG.PSU__PCIE__CLASS_CODE_SUB 0x04 \
  CONFIG.PSU__PCIE__CLASS_CODE_VALUE 0x60400 \
  CONFIG.PSU__PCIE__DEVICE_ID 0xD011 \
  CONFIG.PSU__PCIE__DEVICE_PORT_TYPE {Root Port} \
  CONFIG.PSU__PCIE__EROM_VAL 0x0 \
  CONFIG.PSU__PCIE__INTX_GENERATION 1 \
  CONFIG.PSU__PCIE__LANE0__ENABLE 1 \
  CONFIG.PSU__PCIE__LANE0__IO {GT Lane0} \
  CONFIG.PSU__PCIE__LINK_SPEED {5.0 Gb/s} \
  CONFIG.PSU__PCIE__MAXIMUM_LINK_WIDTH x1 \
  CONFIG.PSU__PCIE__MAX_PAYLOAD_SIZE {256 bytes} \
  CONFIG.PSU__PCIE__PERIPHERAL__ENABLE 1 \
  CONFIG.PSU__PCIE__PERIPHERAL__ENDPOINT_ENABLE 0 \
  CONFIG.PSU__PCIE__PERIPHERAL__ROOTPORT_ENABLE 1 \
  CONFIG.PSU__PCIE__PERIPHERAL__ROOTPORT_IO {MIO 37} \
  CONFIG.PSU__PCIE__REF_CLK_FREQ 100 \
  CONFIG.PSU__PCIE__REF_CLK_SEL {Ref Clk0} \
  CONFIG.PSU__PCIE__REVISION_ID 0x0 \
  CONFIG.PSU__PCIE__SUBSYSTEM_ID 0x7 \
  CONFIG.PSU__PCIE__SUBSYSTEM_VENDOR_ID 0x10EE \
  CONFIG.PSU__PCIE__VENDOR_ID 0x10EE \
  CONFIG.PSU__PMU__PERIPHERAL__ENABLE 0 \
  CONFIG.PSU__PRESET_APPLIED 0 \
  CONFIG.PSU__PSS_REF_CLK__FREQMHZ 33.33333 \
  CONFIG.PSU__QSPI_COHERENCY 0 \
  CONFIG.PSU__QSPI_ROUTE_THROUGH_FPD 0 \
  CONFIG.PSU__QSPI__GRP_FBCLK__ENABLE 0 \
  CONFIG.PSU__QSPI__PERIPHERAL__DATA_MODE x4 \
  CONFIG.PSU__QSPI__PERIPHERAL__ENABLE 1 \
  CONFIG.PSU__QSPI__PERIPHERAL__IO {MIO 0 .. 5} \
  CONFIG.PSU__QSPI__PERIPHERAL__MODE Single \
  CONFIG.PSU__SATA__LANE0__ENABLE 1 \
  CONFIG.PSU__SATA__LANE0__IO {GT Lane2} \
  CONFIG.PSU__SATA__LANE1__ENABLE 1 \
  CONFIG.PSU__SATA__LANE1__IO {GT Lane3} \
  CONFIG.PSU__SATA__PERIPHERAL__ENABLE 1 \
  CONFIG.PSU__SATA__REF_CLK_FREQ 125 \
  CONFIG.PSU__SATA__REF_CLK_SEL {Ref Clk2} \
  CONFIG.PSU__SD0__DATA_TRANSFER_MODE 8Bit \
  CONFIG.PSU__SD0__GRP_POW__ENABLE 1 \
  CONFIG.PSU__SD0__GRP_POW__IO {MIO 23} \
  CONFIG.PSU__SD0__PERIPHERAL__ENABLE 1 \
  CONFIG.PSU__SD0__PERIPHERAL__IO {MIO 13 .. 22} \
  CONFIG.PSU__SD0__RESET__ENABLE 1 \
  CONFIG.PSU__SD0__SLOT_TYPE eMMC \
  CONFIG.PSU__SD1_COHERENCY 0 \
  CONFIG.PSU__SD1_ROUTE_THROUGH_FPD 0 \
  CONFIG.PSU__SD1__DATA_TRANSFER_MODE 4Bit \
  CONFIG.PSU__SD1__GRP_CD__ENABLE 1 \
  CONFIG.PSU__SD1__GRP_CD__IO {MIO 45} \
  CONFIG.PSU__SD1__GRP_POW__ENABLE 0 \
  CONFIG.PSU__SD1__GRP_WP__ENABLE 0 \
  CONFIG.PSU__SD1__PERIPHERAL__ENABLE 1 \
  CONFIG.PSU__SD1__PERIPHERAL__IO {MIO 46 .. 51} \
  CONFIG.PSU__SD1__SLOT_TYPE {SD 2.0} \
  CONFIG.PSU__SWDT0__PERIPHERAL__ENABLE 0 \
  CONFIG.PSU__SWDT1__PERIPHERAL__ENABLE 0 \
  CONFIG.PSU__TSU__BUFG_PORT_PAIR 0 \
  CONFIG.PSU__TTC0__CLOCK__ENABLE 0 \
  CONFIG.PSU__TTC0__PERIPHERAL__ENABLE 1 \
  CONFIG.PSU__TTC0__WAVEOUT__ENABLE 0 \
  CONFIG.PSU__TTC1__CLOCK__ENABLE 0 \
  CONFIG.PSU__TTC1__PERIPHERAL__ENABLE 1 \
  CONFIG.PSU__TTC1__WAVEOUT__ENABLE 0 \
  CONFIG.PSU__TTC2__CLOCK__ENABLE 0 \
  CONFIG.PSU__TTC2__PERIPHERAL__ENABLE 1 \
  CONFIG.PSU__TTC2__WAVEOUT__ENABLE 0 \
  CONFIG.PSU__TTC3__CLOCK__ENABLE 0 \
  CONFIG.PSU__TTC3__PERIPHERAL__ENABLE 1 \
  CONFIG.PSU__TTC3__WAVEOUT__ENABLE 0 \
  CONFIG.PSU__UART0__BAUD_RATE 115200 \
  CONFIG.PSU__UART0__MODEM__ENABLE 0 \
  CONFIG.PSU__UART0__PERIPHERAL__ENABLE 1 \
  CONFIG.PSU__UART0__PERIPHERAL__IO {MIO 42 .. 43} \
  CONFIG.PSU__UART1__BAUD_RATE 115200 \
  CONFIG.PSU__UART1__MODEM__ENABLE 0 \
  CONFIG.PSU__UART1__PERIPHERAL__ENABLE 1 \
  CONFIG.PSU__UART1__PERIPHERAL__IO {MIO 40 .. 41} \
  CONFIG.PSU__USB0_COHERENCY 0 \
  CONFIG.PSU__USB0__PERIPHERAL__ENABLE 1 \
  CONFIG.PSU__USB0__PERIPHERAL__IO {MIO 52 .. 63} \
  CONFIG.PSU__USB0__REF_CLK_FREQ 26 \
  CONFIG.PSU__USB0__REF_CLK_SEL {Ref Clk1} \
  CONFIG.PSU__USB0__RESET__ENABLE 1 \
  CONFIG.PSU__USB0__RESET__IO {MIO 31} \
  CONFIG.PSU__USB2_0__EMIO__ENABLE 0 \
  CONFIG.PSU__USB3_0__EMIO__ENABLE 0 \
  CONFIG.PSU__USB3_0__PERIPHERAL__ENABLE 1 \
  CONFIG.PSU__USB3_0__PERIPHERAL__IO {GT Lane1} \
  CONFIG.PSU__USB__RESET__MODE {Shared MIO Pin} \
  CONFIG.PSU__USB__RESET__POLARITY {Active Low} \
  CONFIG.PSU__USE__IRQ0 1 \
  CONFIG.PSU__USE__IRQ1 1 \
  CONFIG.PSU__USE__M_AXI_GP0 1 \
  CONFIG.PSU__USE__M_AXI_GP1 1 \
  CONFIG.PSU__USE__M_AXI_GP2 0 \
  CONFIG.PSU__USE__S_AXI_GP2 1 \
  CONFIG.PSU__USE__S_AXI_GP3 1 \
  CONFIG.QSPI_BOARD_INTERFACE custom \
  CONFIG.SATA_BOARD_INTERFACE custom \
  CONFIG.SD0_BOARD_INTERFACE custom \
  CONFIG.SD1_BOARD_INTERFACE custom \
  CONFIG.SPI0_BOARD_INTERFACE custom \
  CONFIG.SPI1_BOARD_INTERFACE custom \
  CONFIG.SUBPRESET1 Custom \
  CONFIG.SUBPRESET2 Custom \
  CONFIG.SWDT0_BOARD_INTERFACE custom \
  CONFIG.SWDT1_BOARD_INTERFACE custom \
  CONFIG.TRACE_BOARD_INTERFACE custom \
  CONFIG.TTC0_BOARD_INTERFACE custom \
  CONFIG.TTC1_BOARD_INTERFACE custom \
  CONFIG.TTC2_BOARD_INTERFACE custom \
  CONFIG.TTC3_BOARD_INTERFACE custom \
  CONFIG.UART0_BOARD_INTERFACE custom \
  CONFIG.UART1_BOARD_INTERFACE custom \
  CONFIG.USB0_BOARD_INTERFACE custom \
  CONFIG.USB1_BOARD_INTERFACE custom \
] [get_bd_cells zynq_ultra_ps_e_0]
# 766 more settings of zynq_ultra_ps_e_0 are not shown: defaults, MIO pin electricals, DDR timing, and values the tool derives
create_bd_cell -type ip -vlnv xilinx.com:ip:canfd:3.0 canfd_10
set_property -dict {CONFIG.C_EN_APB 0 CONFIG.EN_RX_FIFO_1 false CONFIG.NUM_OF_TX_BUF 8} [get_bd_cells canfd_10]
create_bd_cell -type ip -vlnv xilinx.com:ip:canfd:3.0 canfd_11
set_property -dict {CONFIG.C_EN_APB 0 CONFIG.EN_RX_FIFO_1 false CONFIG.NUM_OF_TX_BUF 8} [get_bd_cells canfd_11]
create_bd_cell -type ip -vlnv xilinx.com:ip:canfd:3.0 canfd_3
set_property -dict {CONFIG.C_EN_APB 0 CONFIG.EN_RX_FIFO_1 false CONFIG.NUM_OF_TX_BUF 8} [get_bd_cells canfd_3]
create_bd_cell -type ip -vlnv xilinx.com:ip:canfd:3.0 canfd_4
set_property -dict {CONFIG.C_EN_APB 0 CONFIG.EN_RX_FIFO_1 false CONFIG.NUM_OF_TX_BUF 8} [get_bd_cells canfd_4]
create_bd_cell -type ip -vlnv xilinx.com:ip:axi_uart16550:2.0 axi_uart16550_0
create_bd_cell -type ip -vlnv xilinx.com:ip:axi_uart16550:2.0 axi_uart16550_1
create_bd_cell -type ip -vlnv xilinx.com:ip:axi_uart16550:2.0 axi_uart16550_2
create_bd_cell -type ip -vlnv xilinx.com:ip:axi_uart16550:2.0 axi_uart16550_3
create_bd_cell -type ip -vlnv xilinx.com:ip:axi_uart16550:2.0 axi_uart16550_4
create_bd_cell -type ip -vlnv xilinx.com:ip:axi_uart16550:2.0 axi_uart16550_5
create_bd_cell -type ip -vlnv xilinx.com:ip:axi_uart16550:2.0 axi_uart16550_6
create_bd_cell -type ip -vlnv xilinx.com:ip:axi_uart16550:2.0 axi_uart16550_7
create_bd_cell -type ip -vlnv xilinx.com:ip:axi_interconnect:2.1 axi_xc_uart_ipcore
set_property -dict {CONFIG.NUM_MI 8 CONFIG.NUM_SI 1} [get_bd_cells axi_xc_uart_ipcore]
create_bd_cell -type ip -vlnv xilinx.com:ip:axi_uartlite:2.0 axi_uartlite_0
create_bd_cell -type ip -vlnv xilinx.com:ip:axi_uartlite:2.0 axi_uartlite_1
create_bd_cell -type ip -vlnv xilinx.com:ip:xlconstant:1.1 sgmii_signal_detect
create_bd_cell -type ip -vlnv xilinx.com:hls:timestamp:1.0 timestamp_0
create_bd_cell -type ip -vlnv xilinx.com:ip:axi_interconnect:2.1 axi_xc_ps_clu
set_property -dict {CONFIG.NUM_MI 1} [get_bd_cells axi_xc_ps_clu]
create_bd_cell -type ip -vlnv xilinx.com:ip:axi_interconnect:2.1 axi_xc_ps_mac
set_property -dict {CONFIG.NUM_MI 1 CONFIG.NUM_SI 3} [get_bd_cells axi_xc_ps_mac]
create_bd_cell -type ip -vlnv user.org:user:CHIPDLIN:1.02 CHIPDLIN_8
create_bd_cell -type ip -vlnv user.org:user:CHIPDLIN:1.02 CHIPDLIN_9
create_bd_cell -type ip -vlnv xilinx.com:ip:axi_interconnect:2.1 axi_xc_mac2_ipcore
set_property -dict {CONFIG.NUM_MI 3 CONFIG.NUM_SI 2} [get_bd_cells axi_xc_mac2_ipcore]
create_bd_cell -type ip -vlnv xilinx.com:ip:axi_interconnect:2.1 axi_xc_mac0_ipcore
set_property -dict {CONFIG.NUM_MI 3 CONFIG.NUM_SI 2} [get_bd_cells axi_xc_mac0_ipcore]
create_bd_cell -type ip -vlnv xilinx.com:ip:axi_interconnect:2.1 axi_xc_mac1_ipcore
set_property -dict {CONFIG.NUM_MI 3 CONFIG.NUM_SI 2} [get_bd_cells axi_xc_mac1_ipcore]
create_bd_cell -type ip -vlnv xilinx.com:ip:axi_interconnect:2.1 axi_clu_ipcore
set_property -dict {CONFIG.NUM_MI 3 CONFIG.NUM_SI 2} [get_bd_cells axi_clu_ipcore]
create_bd_cell -type ip -vlnv xilinx.com:ip:axi_fifo_mm_s:4.2 axi_ethernet_sw2_fifo1
set_property -dict [list \
  CONFIG.C_DATA_INTERFACE_TYPE 1 \
  CONFIG.C_HAS_AXIS_TKEEP true \
  CONFIG.C_RX_FIFO_DEPTH 2048 \
  CONFIG.C_RX_FIFO_PE_THRESHOLD 10 \
  CONFIG.C_RX_FIFO_PF_THRESHOLD 2043 \
  CONFIG.C_TX_FIFO_DEPTH 4096 \
  CONFIG.C_TX_FIFO_PE_THRESHOLD 10 \
  CONFIG.C_TX_FIFO_PF_THRESHOLD 4000 \
] [get_bd_cells axi_ethernet_sw2_fifo1]
create_bd_cell -type ip -vlnv xilinx.com:ip:axi_fifo_mm_s:4.2 axi_ethernet_sw1_fifo1
set_property -dict [list \
  CONFIG.C_DATA_INTERFACE_TYPE 1 \
  CONFIG.C_HAS_AXIS_TKEEP true \
  CONFIG.C_RX_FIFO_DEPTH 2048 \
  CONFIG.C_RX_FIFO_PE_THRESHOLD 10 \
  CONFIG.C_RX_FIFO_PF_THRESHOLD 2043 \
  CONFIG.C_TX_FIFO_DEPTH 4096 \
  CONFIG.C_TX_FIFO_PE_THRESHOLD 10 \
  CONFIG.C_TX_FIFO_PF_THRESHOLD 4000 \
] [get_bd_cells axi_ethernet_sw1_fifo1]
create_bd_cell -type ip -vlnv xilinx.com:ip:axi_fifo_mm_s:4.2 axi_ethernet_sw0_fifo1
set_property -dict [list \
  CONFIG.C_DATA_INTERFACE_TYPE 1 \
  CONFIG.C_HAS_AXIS_TKEEP true \
  CONFIG.C_RX_FIFO_DEPTH 2048 \
  CONFIG.C_RX_FIFO_PE_THRESHOLD 10 \
  CONFIG.C_RX_FIFO_PF_THRESHOLD 2043 \
  CONFIG.C_TX_FIFO_DEPTH 4096 \
  CONFIG.C_TX_FIFO_PE_THRESHOLD 10 \
  CONFIG.C_TX_FIFO_PF_THRESHOLD 4000 \
] [get_bd_cells axi_ethernet_sw0_fifo1]
create_bd_cell -type ip -vlnv user.org:user:CHIPDLIN:1.02 CHIPDLIN_10
create_bd_cell -type ip -vlnv user.org:user:CHIPDLIN:1.02 CHIPDLIN_11
create_bd_cell -type ip -vlnv xilinx.com:hls:clu:1.0 clu_0
set_property -dict [list \
  CONFIG.C_M_AXI_CLU_ADDR_DATA_WIDTH 32 \
  CONFIG.C_M_AXI_CLU_ADDR_ENABLE_ID_PORTS false \
  CONFIG.C_M_AXI_PS_DDR_DATA_WIDTH 32 \
  CONFIG.C_M_AXI_PS_DDR_ENABLE_ID_PORTS false \
] [get_bd_cells clu_0]
create_bd_cell -type ip -vlnv xilinx.com:hls:mac_logger:1.0 mac_logger_2
set_property -dict [list \
  CONFIG.C_M_AXI_MAC_FIFO_ENABLE_ID_PORTS false \
  CONFIG.C_M_AXI_PS_DATA_WIDTH 64 \
  CONFIG.C_M_AXI_PS_ENABLE_ID_PORTS false \
] [get_bd_cells mac_logger_2]
create_bd_cell -type ip -vlnv xilinx.com:hls:mac_logger:1.0 mac_logger_1
set_property -dict [list \
  CONFIG.C_M_AXI_MAC_FIFO_ENABLE_ID_PORTS false \
  CONFIG.C_M_AXI_PS_DATA_WIDTH 64 \
  CONFIG.C_M_AXI_PS_ENABLE_ID_PORTS false \
] [get_bd_cells mac_logger_1]
create_bd_cell -type ip -vlnv xilinx.com:hls:mac_logger:1.0 mac_logger_0
set_property -dict [list \
  CONFIG.C_M_AXI_MAC_FIFO_ENABLE_ID_PORTS false \
  CONFIG.C_M_AXI_PS_DATA_WIDTH 64 \
  CONFIG.C_M_AXI_PS_ENABLE_ID_PORTS false \
] [get_bd_cells mac_logger_0]
create_bd_cell -type ip -vlnv xilinx.com:ip:axi_ethernet:7.2 axi_ethernet_0
set_property -dict [list \
  CONFIG.ENABLE_LVDS false \
  CONFIG.Frame_Filter false \
  CONFIG.PHYADDR 16 \
  CONFIG.PHY_TYPE SGMII \
  CONFIG.SupportLevel 1 \
  CONFIG.gtlocation X0Y4 \
  CONFIG.speed_1_2p5 1G \
] [get_bd_cells axi_ethernet_0]
create_bd_cell -type ip -vlnv xilinx.com:ip:util_ds_buf:2.1 util_ds_buf_0
set_property -dict {CONFIG.C_BUF_TYPE BUFG_GT} [get_bd_cells util_ds_buf_0]
create_bd_cell -type ip -vlnv xilinx.com:ip:xlconstant:1.1 sgmii_signal_detect1
set_property -dict {CONFIG.CONST_VAL b000 CONFIG.CONST_WIDTH 3} [get_bd_cells sgmii_signal_detect1]
create_bd_cell -type ip -vlnv xilinx.com:ip:xlconstant:1.1 sgmii_signal_detect2
set_property -dict {CONFIG.CONST_VAL 0} [get_bd_cells sgmii_signal_detect2]
create_bd_cell -type ip -vlnv xilinx.com:ip:util_ds_buf:2.1 util_ds_buf_1
set_property -dict {CONFIG.C_BUF_TYPE BUFG_GT} [get_bd_cells util_ds_buf_1]

# ---- connections ----

connect_bd_intf_net [get_bd_intf_pins axi_ethernet_sw0_fifo/S_AXI] [get_bd_intf_pins axi_xc_mac0_ipcore/M00_AXI]
connect_bd_intf_net [get_bd_intf_pins axi_xc_lin_ipcore/M07_AXI] [get_bd_intf_pins CHIPDLIN_7/S00_AXI]
connect_bd_intf_net [get_bd_intf_pins axi_xc_lin_ipcore/M05_AXI] [get_bd_intf_pins CHIPDLIN_5/S00_AXI]
connect_bd_intf_net [get_bd_intf_ports mdio_sw2] [get_bd_intf_pins axi_ethernet_2/mdio]
connect_bd_intf_net [get_bd_intf_pins axi_xc_canfd_ipcore/M01_AXI] [get_bd_intf_pins canfd_1/CAN_S_AXI_LITE]
connect_bd_intf_net [get_bd_intf_pins axi_xc_lin_ipcore/M00_AXI] [get_bd_intf_pins CHIPDLIN_0/S00_AXI]
connect_bd_intf_net [get_bd_intf_pins axi_xc_lin_ipcore/M04_AXI] [get_bd_intf_pins CHIPDLIN_4/S00_AXI]
connect_bd_intf_net [get_bd_intf_pins zynq_ultra_ps_e_0/GMII_ENET0] [get_bd_intf_pins gmii_to_rgmii_0/GMII]
connect_bd_intf_net [get_bd_intf_pins ps8_1_axi_periph/S00_AXI] [get_bd_intf_pins zynq_ultra_ps_e_0/M_AXI_HPM1_FPD]
connect_bd_intf_net [get_bd_intf_pins axi_xc_canfd_ipcore/M03_AXI] [get_bd_intf_pins canfd_5/CAN_S_AXI_LITE]
connect_bd_intf_net [get_bd_intf_pins gmii_to_rgmii_1/MDIO_GEM] [get_bd_intf_pins zynq_ultra_ps_e_0/MDIO_ENET1]
connect_bd_intf_net [get_bd_intf_ports mdio_sw1] [get_bd_intf_pins axi_ethernet_1/mdio]
connect_bd_intf_net [get_bd_intf_pins gmii_to_rgmii_2/MDIO_GEM] [get_bd_intf_pins zynq_ultra_ps_e_0/MDIO_ENET2]
connect_bd_intf_net [get_bd_intf_ports ps_enet1] [get_bd_intf_pins gmii_to_rgmii_1/RGMII]
connect_bd_intf_net [get_bd_intf_pins axi_ethernet_2/s_axi] [get_bd_intf_pins axi_xc_mac2_ipcore/M01_AXI]
connect_bd_intf_net [get_bd_intf_pins axi_ethernet_sw1_fifo1/S_AXI] [get_bd_intf_pins axi_xc_mac1_ipcore/M02_AXI]
connect_bd_intf_net [get_bd_intf_pins axi_ethernet_sw2_fifo1/S_AXI] [get_bd_intf_pins axi_xc_mac2_ipcore/M02_AXI]
connect_bd_intf_net [get_bd_intf_pins axi_xc_mac2_ipcore/S00_AXI] [get_bd_intf_pins ps8_1_axi_periph/M00_AXI]
connect_bd_intf_net [get_bd_intf_pins axi_ethernet_1/m_axis_rxd] [get_bd_intf_pins axi_ethernet_sw1_fifo1/AXI_STR_RXD]
connect_bd_intf_net [get_bd_intf_pins axi_ethernet_sw2_fifo1/AXI_STR_RXD] [get_bd_intf_pins axi_ethernet_2/m_axis_rxd]
connect_bd_intf_net [get_bd_intf_pins mac_logger_2/s_axi_axilites] [get_bd_intf_pins ps8_1_axi_periph/M05_AXI]
connect_bd_intf_net [get_bd_intf_pins axi_xc_canfd_ipcore/M06_AXI] [get_bd_intf_pins canfd_8/CAN_S_AXI_LITE]
connect_bd_intf_net [get_bd_intf_pins mac_logger_1/m_axi_fifo_axi_full] [get_bd_intf_pins axi_ethernet_sw1_fifo1/S_AXI_FULL]
connect_bd_intf_net [get_bd_intf_pins axi_uart16550_7/S_AXI] [get_bd_intf_pins axi_xc_uart_ipcore/M07_AXI]
connect_bd_intf_net [get_bd_intf_pins axi_ethernet_1/s_axi] [get_bd_intf_pins axi_xc_mac1_ipcore/M01_AXI]
connect_bd_intf_net [get_bd_intf_pins axi_xc_mac0_ipcore/S00_AXI] [get_bd_intf_pins ps8_1_axi_periph/M02_AXI]
connect_bd_intf_net [get_bd_intf_pins mac_logger_0/s_axi_axilites] [get_bd_intf_pins ps8_1_axi_periph/M03_AXI]
connect_bd_intf_net [get_bd_intf_pins mac_logger_0/m_axi_fifo_axi_full] [get_bd_intf_pins axi_ethernet_sw0_fifo1/S_AXI_FULL]
connect_bd_intf_net -intf_net axi_ethernet_4_fifo_AXI_STR_TXD [get_bd_intf_pins axi_ethernet_sw2_fifo/AXI_STR_TXD] [get_bd_intf_pins axi_ethernet_2/s_axis_txd]
connect_bd_intf_net [get_bd_intf_pins axi_ethernet_sw0_fifo1/S_AXI] [get_bd_intf_pins axi_xc_mac0_ipcore/M02_AXI]
connect_bd_intf_net [get_bd_intf_pins axi_xc_mac1_ipcore/S00_AXI] [get_bd_intf_pins ps8_1_axi_periph/M01_AXI]
connect_bd_intf_net [get_bd_intf_ports mdio_ps_enet2] [get_bd_intf_pins gmii_to_rgmii_2/MDIO_PHY]
connect_bd_intf_net [get_bd_intf_pins axi_xc_mac0_ipcore/S01_AXI] [get_bd_intf_pins mac_logger_0/m_axi_mac_fifo]
connect_bd_intf_net [get_bd_intf_pins axi_xc_mac2_ipcore/S01_AXI] [get_bd_intf_pins mac_logger_2/m_axi_mac_fifo]
connect_bd_intf_net [get_bd_intf_pins mac_logger_1/s_axi_axilites] [get_bd_intf_pins ps8_1_axi_periph/M04_AXI]
connect_bd_intf_net [get_bd_intf_pins axi_ethernet_sw2_fifo/S_AXI] [get_bd_intf_pins axi_xc_mac2_ipcore/M00_AXI]
connect_bd_intf_net [get_bd_intf_pins axi_xc_mac1_ipcore/S01_AXI] [get_bd_intf_pins mac_logger_1/m_axi_mac_fifo]
connect_bd_intf_net [get_bd_intf_pins axi_xc_ps_mac/M00_AXI] [get_bd_intf_pins zynq_ultra_ps_e_0/S_AXI_HP1_FPD]
connect_bd_intf_net [get_bd_intf_ports GPIO] [get_bd_intf_pins zynq_ultra_ps_e_0/GPIO_0]
connect_bd_intf_net [get_bd_intf_pins axi_uart16550_1/S_AXI] [get_bd_intf_pins axi_xc_uart_ipcore/M01_AXI]
connect_bd_intf_net [get_bd_intf_ports mdio_ps_enet0] [get_bd_intf_pins gmii_to_rgmii_0/MDIO_PHY]
connect_bd_intf_net [get_bd_intf_pins axi_uart16550_6/S_AXI] [get_bd_intf_pins axi_xc_uart_ipcore/M06_AXI]
connect_bd_intf_net [get_bd_intf_ports sgmii_sw1] [get_bd_intf_pins axi_ethernet_1/sgmii]
connect_bd_intf_net [get_bd_intf_pins axi_xc_lin_ipcore/M09_AXI] [get_bd_intf_pins CHIPDLIN_9/S00_AXI]
connect_bd_intf_net [get_bd_intf_pins axi_xc_lin_ipcore/M02_AXI] [get_bd_intf_pins CHIPDLIN_2/S00_AXI]
connect_bd_intf_net [get_bd_intf_pins axi_xc_lin_ipcore/M06_AXI] [get_bd_intf_pins CHIPDLIN_6/S00_AXI]
connect_bd_intf_net [get_bd_intf_pins axi_xc_canfd_ipcore/M02_AXI] [get_bd_intf_pins canfd_2/CAN_S_AXI_LITE]
connect_bd_intf_net [get_bd_intf_pins axi_uart16550_0/S_AXI] [get_bd_intf_pins axi_xc_uart_ipcore/M00_AXI]
connect_bd_intf_net [get_bd_intf_pins axi_uart16550_3/S_AXI] [get_bd_intf_pins axi_xc_uart_ipcore/M03_AXI]
connect_bd_intf_net [get_bd_intf_pins axi_xc_canfd_ipcore/M07_AXI] [get_bd_intf_pins canfd_9/CAN_S_AXI_LITE]
connect_bd_intf_net [get_bd_intf_pins axi_xc_canfd_ipcore/M00_AXI] [get_bd_intf_pins canfd_0/CAN_S_AXI_LITE]
connect_bd_intf_net [get_bd_intf_ports sgmii_sw2] [get_bd_intf_pins axi_ethernet_2/sgmii]
connect_bd_intf_net [get_bd_intf_pins canfd_10/CAN_S_AXI_LITE] [get_bd_intf_pins axi_xc_canfd_ipcore/M08_AXI]
connect_bd_intf_net [get_bd_intf_pins CHIPDLIN_8/S00_AXI] [get_bd_intf_pins axi_xc_lin_ipcore/M08_AXI]
connect_bd_intf_net [get_bd_intf_ports mdio_ps_enet1] [get_bd_intf_pins gmii_to_rgmii_1/MDIO_PHY]
connect_bd_intf_net [get_bd_intf_pins zynq_ultra_ps_e_0/M_AXI_HPM0_FPD] [get_bd_intf_pins ps8_0_axi_periph/S00_AXI]
connect_bd_intf_net -intf_net axi_ethernet_4_fifo_AXI_STR_TXC [get_bd_intf_pins axi_ethernet_sw2_fifo/AXI_STR_TXC] [get_bd_intf_pins axi_ethernet_2/s_axis_txc]
connect_bd_intf_net [get_bd_intf_ports ps_enet2] [get_bd_intf_pins gmii_to_rgmii_2/RGMII]
connect_bd_intf_net [get_bd_intf_pins axi_xc_lin_ipcore/M01_AXI] [get_bd_intf_pins CHIPDLIN_1/S00_AXI]
connect_bd_intf_net [get_bd_intf_pins axi_xc_canfd_ipcore/M05_AXI] [get_bd_intf_pins canfd_7/CAN_S_AXI_LITE]
connect_bd_intf_net -intf_net axi_ethernet_3_fifo_AXI_STR_TXD [get_bd_intf_pins axi_ethernet_sw1_fifo/AXI_STR_TXD] [get_bd_intf_pins axi_ethernet_1/s_axis_txd]
connect_bd_intf_net [get_bd_intf_pins axi_xc_lin_ipcore/M03_AXI] [get_bd_intf_pins CHIPDLIN_3/S00_AXI]
connect_bd_intf_net [get_bd_intf_pins zynq_ultra_ps_e_0/MDIO_ENET0] [get_bd_intf_pins gmii_to_rgmii_0/MDIO_GEM]
connect_bd_intf_net [get_bd_intf_pins canfd_4/CAN_S_AXI_LITE] [get_bd_intf_pins axi_xc_canfd_ipcore/M11_AXI]
connect_bd_intf_net [get_bd_intf_pins axi_xc_lin_ipcore/M10_AXI] [get_bd_intf_pins CHIPDLIN_10/S00_AXI]
connect_bd_intf_net [get_bd_intf_pins axi_uart16550_5/S_AXI] [get_bd_intf_pins axi_xc_uart_ipcore/M05_AXI]
connect_bd_intf_net -intf_net axi_ethernet_3_fifo_AXI_STR_TXC [get_bd_intf_pins axi_ethernet_sw1_fifo/AXI_STR_TXC] [get_bd_intf_pins axi_ethernet_1/s_axis_txc]
connect_bd_intf_net [get_bd_intf_pins canfd_11/CAN_S_AXI_LITE] [get_bd_intf_pins axi_xc_canfd_ipcore/M09_AXI]
connect_bd_intf_net [get_bd_intf_pins CHIPDLIN_11/S00_AXI] [get_bd_intf_pins axi_xc_lin_ipcore/M11_AXI]
connect_bd_intf_net [get_bd_intf_pins axi_xc_ps_mac/S01_AXI] [get_bd_intf_pins mac_logger_1/m_axi_ps]
connect_bd_intf_net [get_bd_intf_pins zynq_ultra_ps_e_0/S_AXI_HP0_FPD] [get_bd_intf_pins axi_xc_ps_clu/M00_AXI]
connect_bd_intf_net [get_bd_intf_pins axi_xc_uart_ipcore/S00_AXI] [get_bd_intf_pins axi_clu_ipcore/M02_AXI]
connect_bd_intf_net [get_bd_intf_pins axi_clu_ipcore/M01_AXI] [get_bd_intf_pins axi_xc_lin_ipcore/S00_AXI]
connect_bd_intf_net -intf_net axi_ethernet_3_sgmii [get_bd_intf_ports sgmii_sw0] [get_bd_intf_pins axi_ethernet_0/sgmii]
connect_bd_intf_net [get_bd_intf_pins axi_xc_canfd_ipcore/S00_AXI] [get_bd_intf_pins axi_clu_ipcore/M00_AXI]
connect_bd_intf_net -intf_net axi_ethernet_3_mdio [get_bd_intf_ports mdio_sw0] [get_bd_intf_pins axi_ethernet_0/mdio]
connect_bd_intf_net [get_bd_intf_pins ps8_0_axi_periph/M03_AXI] [get_bd_intf_pins axi_uartlite_0/S_AXI]
connect_bd_intf_net [get_bd_intf_pins axi_xc_mac0_ipcore/M01_AXI] [get_bd_intf_pins axi_ethernet_0/s_axi]
connect_bd_intf_net [get_bd_intf_pins axi_uartlite_1/S_AXI] [get_bd_intf_pins ps8_0_axi_periph/M04_AXI]
connect_bd_intf_net [get_bd_intf_pins axi_clu_ipcore/S01_AXI] [get_bd_intf_pins clu_0/m_axi_clu_addr]
connect_bd_intf_net [get_bd_intf_pins clu_0/m_axi_ps_ddr] [get_bd_intf_pins axi_xc_ps_clu/S00_AXI]
connect_bd_intf_net [get_bd_intf_ports ps_enet0] [get_bd_intf_pins gmii_to_rgmii_0/RGMII]
connect_bd_intf_net -intf_net axi_ethernet_3_m_axis_rxd [get_bd_intf_pins axi_ethernet_sw0_fifo1/AXI_STR_RXD] [get_bd_intf_pins axi_ethernet_0/m_axis_rxd]
connect_bd_intf_net [get_bd_intf_pins axi_xc_canfd_ipcore/M04_AXI] [get_bd_intf_pins canfd_6/CAN_S_AXI_LITE]
connect_bd_intf_net [get_bd_intf_pins canfd_3/CAN_S_AXI_LITE] [get_bd_intf_pins axi_xc_canfd_ipcore/M10_AXI]
connect_bd_intf_net [get_bd_intf_pins axi_ethernet_sw0_fifo/AXI_STR_TXD] [get_bd_intf_pins axi_ethernet_0/s_axis_txd]
connect_bd_intf_net -intf_net mac_logger_0_m_axi_ps [get_bd_intf_pins mac_logger_2/m_axi_ps] [get_bd_intf_pins axi_xc_ps_mac/S00_AXI]
connect_bd_intf_net [get_bd_intf_pins axi_xc_ps_mac/S02_AXI] [get_bd_intf_pins mac_logger_0/m_axi_ps]
connect_bd_intf_net [get_bd_intf_pins ps8_0_axi_periph/M00_AXI] [get_bd_intf_pins axi_clu_ipcore/S00_AXI]
connect_bd_intf_net [get_bd_intf_pins ps8_0_axi_periph/M02_AXI] [get_bd_intf_pins timestamp_0/s_axi_ts_base]
connect_bd_intf_net [get_bd_intf_pins ps8_0_axi_periph/M01_AXI] [get_bd_intf_pins clu_0/s_axi_EN]
connect_bd_intf_net [get_bd_intf_pins gmii_to_rgmii_2/GMII] [get_bd_intf_pins zynq_ultra_ps_e_0/GMII_ENET2]
connect_bd_intf_net [get_bd_intf_pins axi_ethernet_sw0_fifo/AXI_STR_TXC] [get_bd_intf_pins axi_ethernet_0/s_axis_txc]
connect_bd_intf_net [get_bd_intf_pins axi_ethernet_sw1_fifo/S_AXI] [get_bd_intf_pins axi_xc_mac1_ipcore/M00_AXI]
connect_bd_intf_net [get_bd_intf_pins mac_logger_2/m_axi_fifo_axi_full] [get_bd_intf_pins axi_ethernet_sw2_fifo1/S_AXI_FULL]
connect_bd_intf_net [get_bd_intf_pins axi_uart16550_2/S_AXI] [get_bd_intf_pins axi_xc_uart_ipcore/M02_AXI]
connect_bd_intf_net [get_bd_intf_pins axi_uart16550_4/S_AXI] [get_bd_intf_pins axi_xc_uart_ipcore/M04_AXI]
connect_bd_intf_net [get_bd_intf_pins gmii_to_rgmii_1/GMII] [get_bd_intf_pins zynq_ultra_ps_e_0/GMII_ENET1]
connect_bd_intf_net -intf_net mgt_clk_sw0_1 [get_bd_intf_ports mgt_clk_sw0] [get_bd_intf_pins axi_ethernet_0/mgt_clk]
connect_bd_net [get_bd_pins rst_ps8_0_100M/peripheral_aresetn] \
  [get_bd_pins CHIPDLIN_0/s00_axi_aresetn] [get_bd_pins CHIPDLIN_1/s00_axi_aresetn] [get_bd_pins CHIPDLIN_2/s00_axi_aresetn] \
  [get_bd_pins CHIPDLIN_3/s00_axi_aresetn] [get_bd_pins CHIPDLIN_4/s00_axi_aresetn] [get_bd_pins CHIPDLIN_5/s00_axi_aresetn] \
  [get_bd_pins CHIPDLIN_6/s00_axi_aresetn] [get_bd_pins CHIPDLIN_7/s00_axi_aresetn] [get_bd_pins axi_xc_lin_ipcore/ARESETN] \
  [get_bd_pins axi_xc_lin_ipcore/S00_ARESETN] [get_bd_pins axi_xc_lin_ipcore/M00_ARESETN] \
  [get_bd_pins axi_xc_lin_ipcore/M01_ARESETN] [get_bd_pins axi_xc_lin_ipcore/M02_ARESETN] \
  [get_bd_pins axi_xc_lin_ipcore/M03_ARESETN] [get_bd_pins axi_xc_lin_ipcore/M04_ARESETN] \
  [get_bd_pins axi_xc_lin_ipcore/M05_ARESETN] [get_bd_pins axi_xc_lin_ipcore/M06_ARESETN] \
  [get_bd_pins axi_xc_lin_ipcore/M07_ARESETN] [get_bd_pins axi_xc_canfd_ipcore/ARESETN] \
  [get_bd_pins axi_xc_canfd_ipcore/S00_ARESETN] [get_bd_pins axi_xc_canfd_ipcore/M00_ARESETN] \
  [get_bd_pins axi_xc_canfd_ipcore/M01_ARESETN] [get_bd_pins axi_xc_canfd_ipcore/M02_ARESETN] \
  [get_bd_pins axi_xc_canfd_ipcore/M03_ARESETN] [get_bd_pins axi_xc_canfd_ipcore/M04_ARESETN] \
  [get_bd_pins axi_xc_canfd_ipcore/M05_ARESETN] [get_bd_pins axi_xc_canfd_ipcore/M06_ARESETN] \
  [get_bd_pins axi_xc_canfd_ipcore/M07_ARESETN] [get_bd_pins canfd_0/s_axi_aresetn] [get_bd_pins canfd_1/s_axi_aresetn] \
  [get_bd_pins canfd_2/s_axi_aresetn] [get_bd_pins canfd_5/s_axi_aresetn] [get_bd_pins canfd_6/s_axi_aresetn] \
  [get_bd_pins canfd_7/s_axi_aresetn] [get_bd_pins canfd_8/s_axi_aresetn] [get_bd_pins canfd_9/s_axi_aresetn] \
  [get_bd_pins ps8_0_axi_periph/S00_ARESETN] [get_bd_pins ps8_0_axi_periph/M00_ARESETN] \
  [get_bd_pins ps8_0_axi_periph/M01_ARESETN] [get_bd_pins ps8_0_axi_periph/M02_ARESETN] \
  [get_bd_pins axi_xc_canfd_ipcore/M08_ARESETN] [get_bd_pins canfd_10/s_axi_aresetn] \
  [get_bd_pins axi_xc_canfd_ipcore/M09_ARESETN] [get_bd_pins canfd_11/s_axi_aresetn] \
  [get_bd_pins axi_xc_canfd_ipcore/M10_ARESETN] [get_bd_pins canfd_3/s_axi_aresetn] \
  [get_bd_pins axi_xc_canfd_ipcore/M11_ARESETN] [get_bd_pins canfd_4/s_axi_aresetn] \
  [get_bd_pins axi_uart16550_0/s_axi_aresetn] [get_bd_pins axi_xc_uart_ipcore/M00_ARESETN] \
  [get_bd_pins axi_uart16550_1/s_axi_aresetn] [get_bd_pins axi_xc_uart_ipcore/M01_ARESETN] \
  [get_bd_pins axi_uart16550_2/s_axi_aresetn] [get_bd_pins axi_xc_uart_ipcore/M02_ARESETN] \
  [get_bd_pins axi_uart16550_3/s_axi_aresetn] [get_bd_pins axi_xc_uart_ipcore/M03_ARESETN] \
  [get_bd_pins axi_uart16550_4/s_axi_aresetn] [get_bd_pins axi_xc_uart_ipcore/M04_ARESETN] \
  [get_bd_pins axi_uart16550_5/s_axi_aresetn] [get_bd_pins axi_xc_uart_ipcore/M05_ARESETN] \
  [get_bd_pins axi_uart16550_6/s_axi_aresetn] [get_bd_pins axi_xc_uart_ipcore/M06_ARESETN] \
  [get_bd_pins axi_uart16550_7/s_axi_aresetn] [get_bd_pins axi_xc_uart_ipcore/M07_ARESETN] \
  [get_bd_pins axi_xc_uart_ipcore/ARESETN] [get_bd_pins axi_xc_uart_ipcore/S00_ARESETN] \
  [get_bd_pins ps8_0_axi_periph/M03_ARESETN] [get_bd_pins ps8_0_axi_periph/M04_ARESETN] \
  [get_bd_pins axi_uartlite_0/s_axi_aresetn] [get_bd_pins axi_uartlite_1/s_axi_aresetn] \
  [get_bd_pins axi_xc_lin_ipcore/M08_ARESETN] [get_bd_pins timestamp_0/ap_rst_n] [get_bd_pins axi_xc_ps_clu/ARESETN] \
  [get_bd_pins axi_xc_ps_clu/M00_ARESETN] [get_bd_pins axi_xc_ps_clu/S00_ARESETN] [get_bd_pins axi_xc_lin_ipcore/M09_ARESETN] \
  [get_bd_pins CHIPDLIN_8/s00_axi_aresetn] [get_bd_pins CHIPDLIN_9/s00_axi_aresetn] [get_bd_pins axi_clu_ipcore/ARESETN] \
  [get_bd_pins axi_clu_ipcore/S00_ARESETN] [get_bd_pins axi_clu_ipcore/M00_ARESETN] [get_bd_pins axi_clu_ipcore/M01_ARESETN] \
  [get_bd_pins axi_clu_ipcore/M02_ARESETN] [get_bd_pins axi_clu_ipcore/S01_ARESETN] [get_bd_pins CHIPDLIN_10/s00_axi_aresetn] \
  [get_bd_pins CHIPDLIN_11/s00_axi_aresetn] [get_bd_pins axi_xc_lin_ipcore/M10_ARESETN] \
  [get_bd_pins axi_xc_lin_ipcore/M11_ARESETN] [get_bd_pins clu_0/ap_rst_n]
connect_bd_net [get_bd_pins rst_ps8_0_100M/interconnect_aresetn] [get_bd_pins ps8_0_axi_periph/ARESETN]
connect_bd_net -net axi_ethernet_2_fifo_s2mm_prmry_reset_out_n [get_bd_pins axi_ethernet_sw0_fifo/s2mm_prmry_reset_out_n] \
  [get_bd_pins axi_ethernet_0/axi_rxd_arstn] [get_bd_pins axi_ethernet_0/axi_rxs_arstn]
connect_bd_net -net axi_ethernet_3_fifo_mm2s_prmry_reset_out_n [get_bd_pins axi_ethernet_sw1_fifo/mm2s_prmry_reset_out_n] \
  [get_bd_pins axi_ethernet_1/axi_txd_arstn]
connect_bd_net -net axi_ethernet_3_fifo_mm2s_cntrl_reset_out_n [get_bd_pins axi_ethernet_sw1_fifo/mm2s_cntrl_reset_out_n] \
  [get_bd_pins axi_ethernet_1/axi_txc_arstn]
connect_bd_net -net axi_ethernet_3_fifo_s2mm_prmry_reset_out_n [get_bd_pins axi_ethernet_sw1_fifo/s2mm_prmry_reset_out_n] \
  [get_bd_pins axi_ethernet_1/axi_rxd_arstn] [get_bd_pins axi_ethernet_1/axi_rxs_arstn]
connect_bd_net -net axi_ethernet_4_fifo_mm2s_prmry_reset_out_n [get_bd_pins axi_ethernet_sw2_fifo/mm2s_prmry_reset_out_n] \
  [get_bd_pins axi_ethernet_2/axi_txd_arstn]
connect_bd_net -net axi_ethernet_4_fifo_mm2s_cntrl_reset_out_n [get_bd_pins axi_ethernet_sw2_fifo/mm2s_cntrl_reset_out_n] \
  [get_bd_pins axi_ethernet_2/axi_txc_arstn]
connect_bd_net -net axi_ethernet_4_fifo_s2mm_prmry_reset_out_n [get_bd_pins axi_ethernet_sw2_fifo/s2mm_prmry_reset_out_n] \
  [get_bd_pins axi_ethernet_2/axi_rxd_arstn] [get_bd_pins axi_ethernet_2/axi_rxs_arstn]
connect_bd_net [get_bd_pins clk_wiz_0/clk_out3] \
  [get_bd_pins axi_ethernet_1/ref_clk] [get_bd_pins axi_ethernet_2/ref_clk] [get_bd_pins axi_ethernet_0/ref_clk]
connect_bd_net [get_bd_pins rst_ps8_0_100M/peripheral_reset] \
  [get_bd_pins gmii_to_rgmii_0/tx_reset] [get_bd_pins gmii_to_rgmii_0/rx_reset] [get_bd_pins gmii_to_rgmii_1/tx_reset] \
  [get_bd_pins gmii_to_rgmii_1/rx_reset] [get_bd_pins gmii_to_rgmii_2/tx_reset] [get_bd_pins gmii_to_rgmii_2/rx_reset]
connect_bd_net [get_bd_pins gmii_to_rgmii_0/ref_clk_out] [get_bd_pins gmii_to_rgmii_1/ref_clk_in] [get_bd_pins gmii_to_rgmii_2/ref_clk_in]
connect_bd_net [get_bd_pins gmii_to_rgmii_0/gmii_clk_25m_out] \
  [get_bd_pins gmii_to_rgmii_1/gmii_clk_25m_in] [get_bd_pins gmii_to_rgmii_2/gmii_clk_25m_in]
connect_bd_net [get_bd_pins gmii_to_rgmii_0/gmii_clk_125m_out] \
  [get_bd_pins gmii_to_rgmii_1/gmii_clk_125m_in] [get_bd_pins gmii_to_rgmii_2/gmii_clk_125m_in]
connect_bd_net [get_bd_pins gmii_to_rgmii_0/gmii_clk_2_5m_out] \
  [get_bd_pins gmii_to_rgmii_1/gmii_clk_2_5m_in] [get_bd_pins gmii_to_rgmii_2/gmii_clk_2_5m_in]
connect_bd_net [get_bd_pins zynq_ultra_ps_e_0/pl_clk1] \
  [get_bd_pins axi_ethernet_sw0_fifo/s_axi_aclk] [get_bd_pins axi_ethernet_1/s_axi_lite_clk] \
  [get_bd_pins axi_ethernet_1/axis_clk] [get_bd_pins axi_ethernet_sw1_fifo/s_axi_aclk] \
  [get_bd_pins axi_ethernet_2/s_axi_lite_clk] [get_bd_pins axi_ethernet_2/axis_clk] \
  [get_bd_pins axi_ethernet_sw2_fifo/s_axi_aclk] [get_bd_pins ps8_1_axi_periph/ACLK] [get_bd_pins ps8_1_axi_periph/S00_ACLK] \
  [get_bd_pins ps8_1_axi_periph/M00_ACLK] [get_bd_pins ps8_1_axi_periph/M01_ACLK] [get_bd_pins ps8_1_axi_periph/M02_ACLK] \
  [get_bd_pins ps8_1_axi_periph/M03_ACLK] [get_bd_pins ps8_1_axi_periph/M04_ACLK] [get_bd_pins ps8_1_axi_periph/M05_ACLK] \
  [get_bd_pins clk_wiz_0/clk_in1] [get_bd_pins rst_sw_mac_100M/slowest_sync_clk] \
  [get_bd_pins zynq_ultra_ps_e_0/maxihpm1_fpd_aclk] [get_bd_pins zynq_ultra_ps_e_0/saxihp1_fpd_aclk] \
  [get_bd_pins axi_xc_ps_mac/M00_ACLK] [get_bd_pins axi_xc_ps_mac/S00_ACLK] [get_bd_pins axi_xc_ps_mac/S01_ACLK] \
  [get_bd_pins axi_xc_ps_mac/S02_ACLK] [get_bd_pins axi_xc_ps_mac/ACLK] [get_bd_pins axi_xc_mac2_ipcore/ACLK] \
  [get_bd_pins axi_xc_mac1_ipcore/ACLK] [get_bd_pins axi_xc_mac0_ipcore/ACLK] [get_bd_pins axi_xc_mac0_ipcore/M00_ACLK] \
  [get_bd_pins axi_xc_mac0_ipcore/M01_ACLK] [get_bd_pins axi_xc_mac0_ipcore/S00_ACLK] \
  [get_bd_pins axi_xc_mac0_ipcore/S01_ACLK] [get_bd_pins axi_xc_mac1_ipcore/M00_ACLK] \
  [get_bd_pins axi_xc_mac1_ipcore/M01_ACLK] [get_bd_pins axi_xc_mac1_ipcore/S00_ACLK] \
  [get_bd_pins axi_xc_mac1_ipcore/S01_ACLK] [get_bd_pins axi_xc_mac2_ipcore/M00_ACLK] \
  [get_bd_pins axi_xc_mac2_ipcore/M01_ACLK] [get_bd_pins axi_xc_mac2_ipcore/S00_ACLK] \
  [get_bd_pins axi_xc_mac2_ipcore/S01_ACLK] [get_bd_pins axi_xc_mac2_ipcore/M02_ACLK] \
  [get_bd_pins axi_xc_mac1_ipcore/M02_ACLK] [get_bd_pins axi_xc_mac0_ipcore/M02_ACLK] \
  [get_bd_pins axi_ethernet_sw2_fifo1/s_axi_aclk] [get_bd_pins axi_ethernet_sw1_fifo1/s_axi_aclk] \
  [get_bd_pins axi_ethernet_sw0_fifo1/s_axi_aclk] [get_bd_pins mac_logger_2/ap_clk] [get_bd_pins mac_logger_1/ap_clk] \
  [get_bd_pins mac_logger_0/ap_clk] [get_bd_pins axi_ethernet_0/s_axi_lite_clk] [get_bd_pins axi_ethernet_0/axis_clk]
